# Altium project SVPXFMC_Carrier_3U.PrjPcb (part 1 of 7)
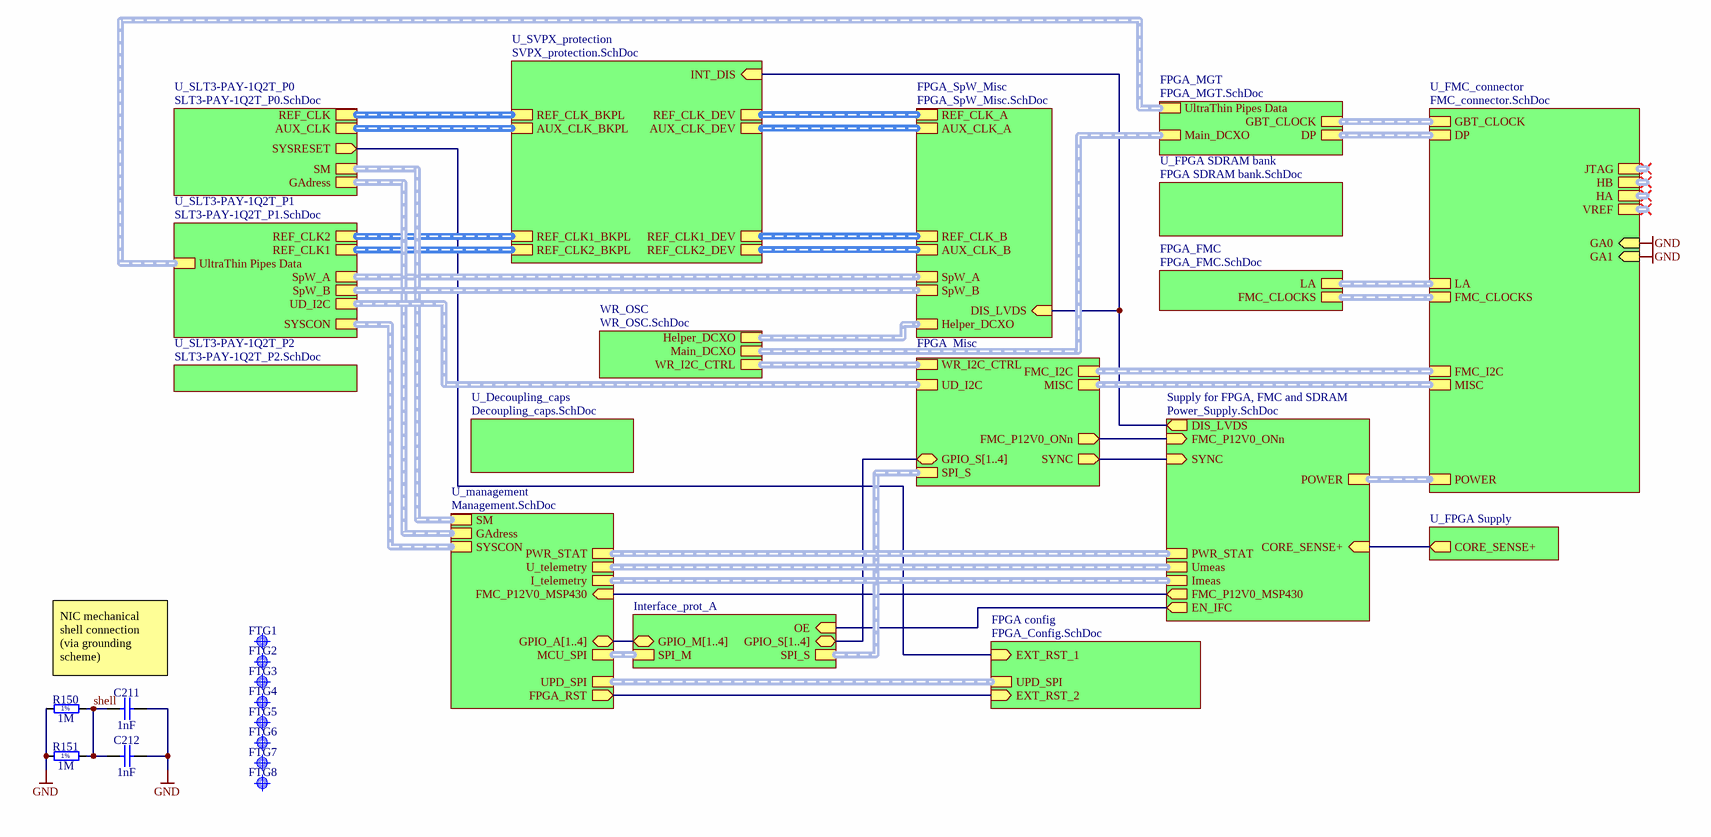
[diagram p0: SVPXFMC_Carrier_3U.SchDoc]
ProjectAddress1: IBP Shanghai; ProjectAddress2: Level 3 - Building 3; ProjectAddress3: No.168 Linhong Road; ProjectAddress4: Shanghai 200335, China; ProjectOrganization: Altium; ProjectTitle: VPX 6U; Template Family: VPX; Template Notes: - Nominal values used, all dimensions are mm.  - Stackup is not specified in AV46DOT0.PDF, nor implemented in this template.  - The component height constraint is defined in AV46DOT0.pdf, page 90.; Template Revision Date: May 2011; Template Source Document: AV46DOT0.pdf; Template Source Name: ANSI/VITA 46.0-2007; Template Source Organization: VITA; Template Source Revision Date: Oct-2007; Template Source URL: www.vita.com
20 sheets, 553 parts. Net scope: hierarchical (ports join the sheet entries above them; power ports are global).
Board file: SVPXFMC_Carrier_3U.PcbDoc
Sheets:
  SVPXFMC_Carrier_3U.SchDoc
    Interface_prot_A = Interface_Protection.SchDoc
    U_FMC_connector = FMC_connector.SchDoc
    FPGA_FMC = FPGA_FMC.SchDoc
    FPGA_Misc = FPGA_Misc.SchDoc
    FPGA_MGT = FPGA_MGT.SchDoc
    Supply for FPGA, FMC and SDRAM = Power_supply.SchDoc
    U_FPGA SDRAM bank = FPGA SDRAM bank.SchDoc
    U_FPGA Supply = FPGA Supply.SchDoc
    FPGA config = FPGA_Config.SchDoc
    U_Decoupling_caps = Decoupling_caps.SchDoc
    FPGA_SpW_Misc = FPGA_SpW_Misc.SchDoc
    U_SLT3-PAY-1Q2T_P0 = SLT3-PAY-1Q2T_P0.SchDoc
    U_SLT3-PAY-1Q2T_P1 = SLT3-PAY-1Q2T_P1.SchDoc
    U_SLT3-PAY-1Q2T_P2 = SLT3-PAY-1Q2T_P2.SchDoc
    U_management = Management.SchDoc
      U_NIC_MSP430_power_jtag = MSP430_power_jtag.SchDoc
    WR_OSC = WR_OSC.SchDoc
    U_SVPX_protection = SVPX_protection.SchDoc
      CLK_prot = CLK_Protection.SchDoc
      CLK_prot_2 = CLK_Protection.SchDoc

## Sheet SVPXFMC_Carrier_3U.SchDoc: SVPXFMC Carrier 3U
size 420 x 297 mm; CheckedBy: \; Author: G.Kasprowicz; CompanyName: ISE; DrawnBy: T.Przywozki; Organization: WUT ISE; Address1: Warsaw University of Technology; Address2: Nowowiejska 15/19 00-665 Warsaw; Revision: 1.0.; SheetNumber: 1; SheetTotal: 20; ModifiedBy: -; CheckedDate: -; Title2: Top; DivGrp: ISE; Designer: G.Kasprowicz; Project: SVPXFMC Carrier 3U; ModifiedDate: -; ProjectName: FMC SFP 4

### Parts
C211  1nF  [CAPC1005X55N]
C212  1nF  [CAPC1005X55N]
FTG1  Use only in PCB  [FIDUCIAL_TOP_C100-200]  (value not drawn)
FTG2  Use only in PCB  [FIDUCIAL_TOP_C100-200]  (value not drawn)
FTG3  Use only in PCB  [FIDUCIAL_TOP_C100-200]  (value not drawn)
FTG4  Use only in PCB  [FIDUCIAL_TOP_C100-200]  (value not drawn)
FTG5  Use only in PCB  [FIDUCIAL_TOP_C100-200]  (value not drawn)
FTG6  Use only in PCB  [FIDUCIAL_TOP_C100-200]  (value not drawn)
FTG7  Use only in PCB  [FIDUCIAL_TOP_C100-200]  (value not drawn)
FTG8  Use only in PCB  [FIDUCIAL_TOP_C100-200]  (value not drawn)
R150  1M  [RESC1005X40N]
R151  1M  [RESC1005X40N]

### Sub-sheets
FPGA config = FPGA_Config.SchDoc: UPD_SPI (harness UPD_SPI), EXT_RST_1 (in), EXT_RST_2 (in)
FPGA_FMC = FPGA_FMC.SchDoc: LA (harness FMC_J1_LA), FMC_CLOCKS (harness FMC_CLOCKS)
FPGA_MGT = FPGA_MGT.SchDoc: GBT_CLOCK (harness GBT_CLOCK), DP (harness FMC_J1_DP), Main_DCXO (harness DIFF_CLK), UltraThin Pipes Data (harness UTP_Data)
FPGA_Misc = FPGA_Misc.SchDoc: SYNC (out), GPIO_S[1..4] (bidir), SPI_S (harness SPI), FMC_I2C (harness I2C), MISC (harness MISC), WR_I2C_CTRL (harness WR_I2C_CTRL), FMC_P12V0_ONn (out), UD_I2C (harness I2C)
FPGA_SpW_Misc = FPGA_SpW_Misc.SchDoc: SpW_B (harness SpW), SpW_A (harness SpW), REF_CLK_A (harness CLK), REF_CLK_B (harness CLK), DIS_LVDS (in), AUX_CLK_A (harness CLK), AUX_CLK_B (harness CLK), Helper_DCXO (harness DIFF_CLK)
Interface_prot_A = Interface_Protection.SchDoc: SPI_M (harness SPI), SPI_S (harness SPI), OE (in), GPIO_S[1..4] (bidir), GPIO_M[1..4] (bidir)
Supply for FPGA, FMC and SDRAM = Power_Supply.SchDoc: Imeas (harness Imeas), SYNC (in), POWER (harness FMC_POWER), CORE_SENSE+ (in), FMC_P12V0_ONn (in), PWR_STAT (harness PWR_STAT), Umeas (harness Umeas), DIS_LVDS (out), EN_IFC (out), FMC_P12V0_MSP430 (out)
U_Decoupling_caps = Decoupling_caps.SchDoc: no entries
U_FMC_connector = FMC_connector.SchDoc: DP (harness FMC_J1_DP), LA (harness FMC_J1_LA), HA (harness FMC_J1_HA), HB (harness FMC_J1_HB), MISC (harness MISC), POWER (harness FMC_POWER), JTAG (harness FMC_J1_JTAG), FMC_I2C (harness I2C), FMC_CLOCKS (harness FMC_CLOCKS), VREF (harness FMC_J1_VREF), GA0 (in), GA1 (in), GBT_CLOCK (harness GBT_CLOCK)
U_FPGA SDRAM bank = FPGA SDRAM bank.SchDoc: no entries
U_FPGA Supply = FPGA Supply.SchDoc: CORE_SENSE+ (out)
U_management = Management.SchDoc: MCU_SPI (harness SPI), SM (harness SM), GAdress (harness GAdress), U_telemetry (harness Umeas), I_telemetry (harness Imeas), FPGA_RST (out), UPD_SPI (harness UPD_SPI), SYSCON (harness SYSCON), PWR_STAT (harness PWR_STAT), GPIO_A[1..4] (bidir), FMC_P12V0_MSP430 (in)
U_SLT3-PAY-1Q2T_P0 = SLT3-PAY-1Q2T_P0.SchDoc: AUX_CLK (harness CLK), REF_CLK (harness CLK), GAdress (harness GAdress), SM (harness SM), SYSRESET (out)
U_SLT3-PAY-1Q2T_P1 = SLT3-PAY-1Q2T_P1.SchDoc: SpW_A (harness SpW), SpW_B (harness SpW), REF_CLK1 (harness CLK), REF_CLK2 (harness CLK), SYSCON (harness SYSCON), UD_I2C (harness I2C), UltraThin Pipes Data
U_SLT3-PAY-1Q2T_P2 = SLT3-PAY-1Q2T_P2.SchDoc: no entries
U_SVPX_protection = SVPX_protection.SchDoc: REF_CLK_BKPL (harness CLK), AUX_CLK_BKPL (harness CLK), AUX_CLK_DEV (harness CLK), REF_CLK_DEV (harness CLK), INT_DIS (in), REF_CLK1_BKPL (harness CLK), REF_CLK2_BKPL (harness CLK), REF_CLK1_DEV (harness CLK), REF_CLK2_DEV (harness CLK)
WR_OSC = WR_OSC.SchDoc: WR_I2C_CTRL (harness WR_I2C_CTRL), Main_DCXO (harness DIFF_CLK), Helper_DCXO (harness DIFF_CLK)

### Nets
GND: C211.2 C212.2 R150.1 R151.1 ; sheet U_FMC_connector/GA0, sheet U_FMC_connector/GA1
CORE_SENSE+: sheet Supply for FPGA, FMC and SDRAM/CORE_SENSE+, sheet U_FPGA Supply/CORE_SENSE+
DIS_LVDS: sheet Supply for FPGA, FMC and SDRAM/DIS_LVDS, sheet FPGA_SpW_Misc/DIS_LVDS, sheet U_SVPX_protection/INT_DIS
EN_IFC: sheet Interface_prot_A/OE, sheet Supply for FPGA, FMC and SDRAM/EN_IFC
EXT_RST_2: sheet FPGA config/EXT_RST_2, sheet U_management/FPGA_RST
FMC_P12V0_MSP430: sheet Supply for FPGA, FMC and SDRAM/FMC_P12V0_MSP430, sheet U_management/FMC_P12V0_MSP430
FMC_P12V0_ONn: sheet FPGA_Misc/FMC_P12V0_ONn, sheet Supply for FPGA, FMC and SDRAM/FMC_P12V0_ONn
shell: C211.1 C212.1 R150.2 R151.2  [project net shell_1]
SYNC: sheet FPGA_Misc/SYNC, sheet Supply for FPGA, FMC and SDRAM/SYNC
SYSRESET*: sheet FPGA config/EXT_RST_1, sheet U_SLT3-PAY-1Q2T_P0/SYSRESET

### Buses and harness runs
bus sheet FPGA_Misc/GPIO_S[1..4] = sheet Interface_prot_A/GPIO_S[1..4]
bus sheet Interface_prot_A/GPIO_M[1..4] = sheet U_management/GPIO_A[1..4]
harness sheet FPGA config/UPD_SPI = sheet U_management/UPD_SPI
harness sheet FPGA_FMC/FMC_CLOCKS = sheet U_FMC_connector/FMC_CLOCKS
harness sheet FPGA_FMC/LA = sheet U_FMC_connector/LA
harness sheet FPGA_MGT/DP = sheet U_FMC_connector/DP
harness sheet FPGA_MGT/GBT_CLOCK = sheet U_FMC_connector/GBT_CLOCK
harness sheet FPGA_MGT/Main_DCXO = sheet WR_OSC/Main_DCXO
harness sheet FPGA_MGT/UltraThin Pipes Data = sheet U_SLT3-PAY-1Q2T_P1/UltraThin Pipes Data
harness sheet FPGA_Misc/FMC_I2C = sheet U_FMC_connector/FMC_I2C
harness sheet FPGA_Misc/MISC = sheet U_FMC_connector/MISC
harness sheet FPGA_Misc/SPI_S = sheet Interface_prot_A/SPI_S
harness sheet FPGA_Misc/UD_I2C = sheet U_SLT3-PAY-1Q2T_P1/UD_I2C
harness sheet FPGA_Misc/WR_I2C_CTRL = sheet WR_OSC/WR_I2C_CTRL
harness sheet FPGA_SpW_Misc/AUX_CLK_A = sheet U_SVPX_protection/AUX_CLK_DEV
harness sheet FPGA_SpW_Misc/AUX_CLK_B = sheet U_SVPX_protection/REF_CLK2_DEV
harness sheet FPGA_SpW_Misc/Helper_DCXO = sheet WR_OSC/Helper_DCXO
harness sheet FPGA_SpW_Misc/REF_CLK_A = sheet U_SVPX_protection/REF_CLK_DEV
harness sheet FPGA_SpW_Misc/REF_CLK_B = sheet U_SVPX_protection/REF_CLK1_DEV
harness sheet FPGA_SpW_Misc/SpW_A = sheet U_SLT3-PAY-1Q2T_P1/SpW_A
harness sheet FPGA_SpW_Misc/SpW_B = sheet U_SLT3-PAY-1Q2T_P1/SpW_B
harness sheet Interface_prot_A/SPI_M = sheet U_management/MCU_SPI
harness sheet Supply for FPGA, FMC and SDRAM/Imeas = sheet U_management/I_telemetry
harness sheet Supply for FPGA, FMC and SDRAM/POWER = sheet U_FMC_connector/POWER
harness sheet Supply for FPGA, FMC and SDRAM/PWR_STAT = sheet U_management/PWR_STAT
harness sheet Supply for FPGA, FMC and SDRAM/Umeas = sheet U_management/U_telemetry
harness sheet U_management/GAdress = sheet U_SLT3-PAY-1Q2T_P0/GAdress
harness sheet U_management/SM = sheet U_SLT3-PAY-1Q2T_P0/SM
harness sheet U_management/SYSCON = sheet U_SLT3-PAY-1Q2T_P1/SYSCON
harness sheet U_SLT3-PAY-1Q2T_P0/AUX_CLK = sheet U_SVPX_protection/AUX_CLK_BKPL
harness sheet U_SLT3-PAY-1Q2T_P0/REF_CLK = sheet U_SVPX_protection/REF_CLK_BKPL
harness sheet U_SLT3-PAY-1Q2T_P1/REF_CLK1 = sheet U_SVPX_protection/REF_CLK2_BKPL
harness sheet U_SLT3-PAY-1Q2T_P1/REF_CLK2 = sheet U_SVPX_protection/REF_CLK1_BKPL

### Notes on the sheet
- NIC mechanical shell connection (via grounding scheme)
- Project/Equipment
- Document
- Designer
- Drawn by
- Check.by
- File
- Last Mod.
- Print Date
- Sheet
- Size
- A3
- of
- Rev
- Copyright WUT ISE 2019
  This documentation describes Open Hardware and is licensed under the CERN OHL v.1.1. You may redistribute and modify this documentation under the terms of the CERN OHL v1.1.
  (http://ohwr.org/CERNOHL). This documentation is dristributed WITHOUT ANY EXPRESS OR IMPLIED WARRANTY, INCLUDING OF MERCHANTABILITY, SATISFACTORY QUALITY AND FITNESS FOR A PARTICULAR PURPOSE. Please see the CERN OHL v.1.1 for applicable conditions
- (in symbol R0402_1M_1%_0.0625W_100PPM) 1%

### Library data of the parts
C211 C212 = CC0402_1NF_50V_10%_X7R: Non-polarised capacitor; Part Description: SMD Multilayer Chip Ceramic Capacitor; Manufacturer: GENERIC; Manufacturer1 Part Number: 223858715623; Voltage: 50V; TC: X7R; Tolerance: ±10%; Part Number: CC0402_1NF_50V_10%_X7R; Component Kind: Standard; Component Type: Standard; Pin Count: 2; Value: 1nF; Status: Not Recommended; Manufacturer Part Number: CC0402_1NF_50V_10%_X7R; Case: 0402; Mounted: Yes; Socket: No; SMD: Yes; Sense: No; Manufacturer1 Example: PHYCOMP; Manufacturer1 ComponentHeight: 0.55mm; HelpURL: \\cern.ch\dfs\Applications\Altium\Datasheets\CC0402_X7R_PHYCOMP.pdf; Author: CERN DEM JLC; CreateDate: 03.12.2007; LatestRevisionDate: 03.12.2007
FTG1-FTG8 = FIDUCIAL_TARGET_C100-200: Fiducial Target; Part Description: Round Fiducial Target, Top Layer, 1.0mm, Top Solder 2.0mm, Keepout =2.0mm; Mounted: No; Part Number: FIDUCIAL_TARGET_C100-200; Component Kind: Standard (No BOM); Component Type: Standard (No BOM); Pin Count: 1; Family: Fiducial; Socket: No; SMD: Yes; Sense: No; Status: None; ComponentHeight: 0mm; HelpURL: Undefined; Author: CERN DEM JLC; CreateDate: 09.02.2010; LatestRevisionDate: 04.04.2012; PackageDescription: Round Fiducial Target, Top Layer, 1.0mm, Top Solder 2.0mm, Keepout =2.0mm
R150 R151 = R0402_1M_1%_0.0625W_100PPM: Resistor - 1%; Part Description: General Purpose Thick Film Chip Resistor; Manufacturer: GENERIC; Manufacturer1 Part Number: 232270671005L; TC: ±100ppm/°C; PressFit: No; Part Number: R0402_1M_1%_0.0625W_100PPM; Component Kind: Standard; Component Type: Standard; Pin Count: 2; Value: 1M; Status: Not Recommended; Power: 0.0625W; Tolerance: ±1%; Manufacturer Part Number: R0402_1M_1%_0.0625W_100PPM; Case: 0402; Mounted: Yes; Sense: No; Socket: No; SMD: Yes; Manufacturer1 Example: YAGEO PHYCOMP; Manufacturer1 ComponentHeight: 0.4mm; HelpURL: \\cern.ch\dfs\Applications\Altium\Datasheets\R0402_Phycomp_RC0402.pdf; Author: CERN DEM JLC; CreateDate: 03.12.2007; LatestRevisionDate: 17.10.2012

## Sheet Interface_Protection.SchDoc: SVPXFMC Carrier 3U
size A4; CheckedBy: \; Author: G.Kasprowicz; CompanyName: ISE; DrawnBy: T.Przywozki; Organization: WUT ISE; Address1: Warsaw University of Technology; Address2: Nowowiejska 15/19 00-665 Warsaw; Revision: 1.0.; SheetNumber: 10; SheetTotal: 20; Project: SVPXFMC Carrier 3U; ModifiedBy: -; CheckedDate: -; Title2: Interface Protection; DivGrp: ISE; Designer: G. Kasprowicz
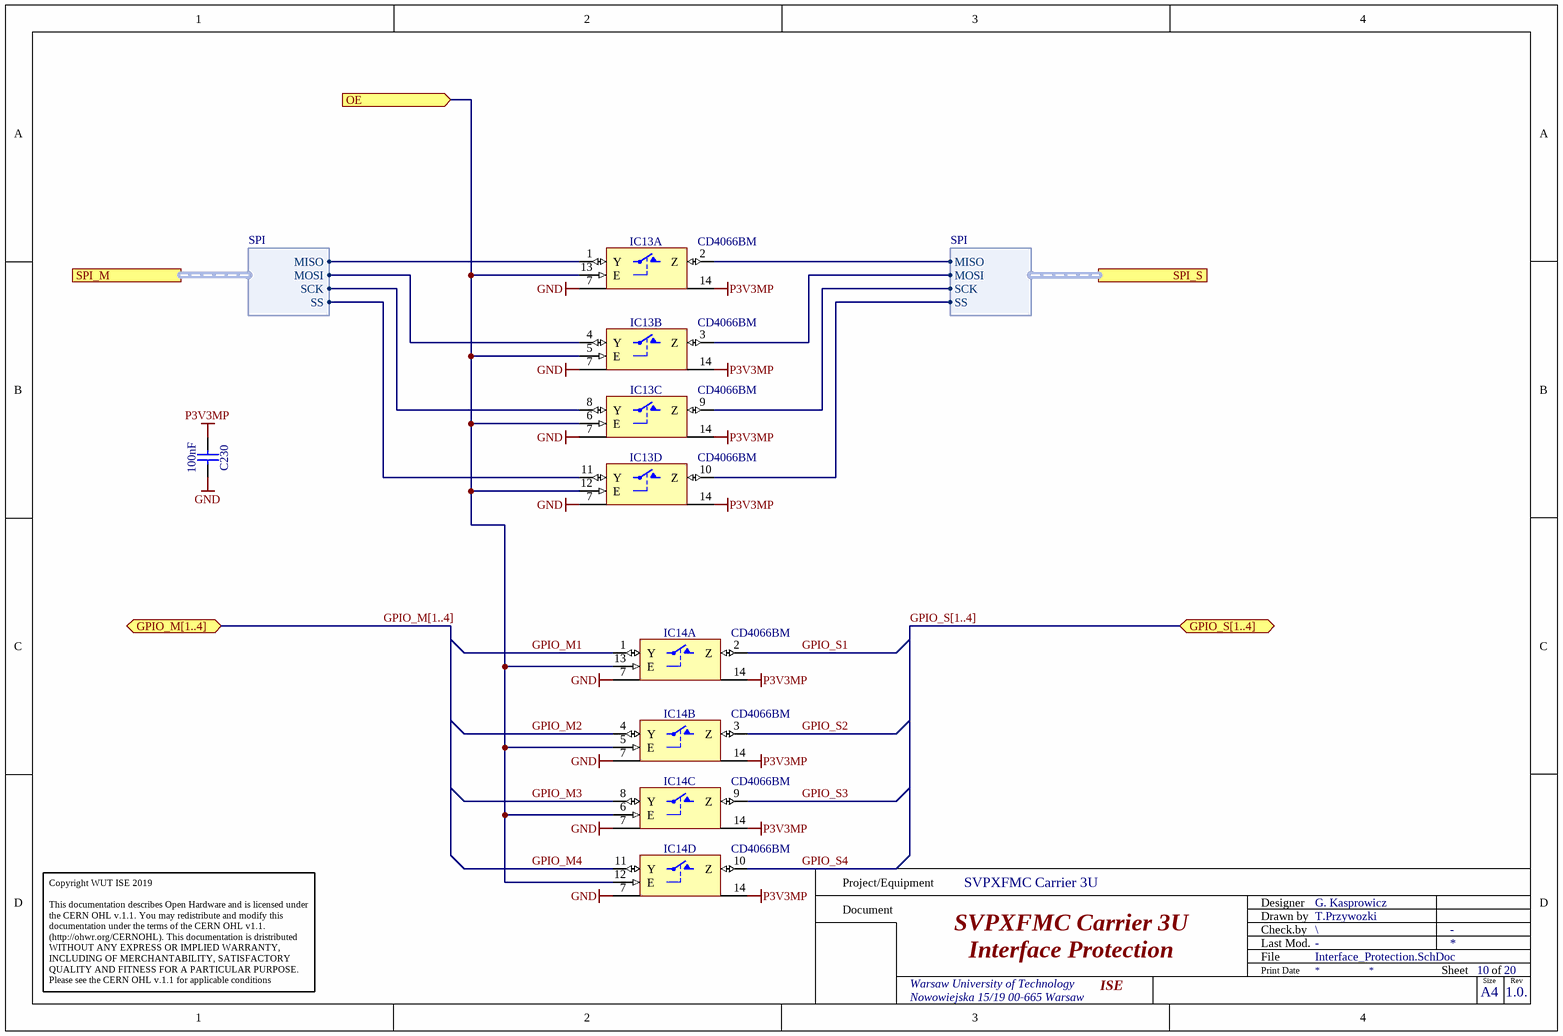
[diagram p1: Interface_Protection.SchDoc]

### Parts
C230  100nF  [CAPC1005X55N]
IC13  CD4066BM  [SOIC127P600X175-14N]  (parts A,B,C,D of 4)
IC14  CD4066BM  [SOIC127P600X175-14N]  (parts A,B,C,D of 4)

### Ports
GPIO_M[1..4] (bidir), GPIO_S[1..4] (bidir), OE (in), SPI_M (harness SPI), SPI_S (harness SPI)

### Harnesses
SPI: MISO, MOSI, SCK, SS

### Nets
GND: C230.2 IC13.7(VSS) IC14.7(VSS)
P3V3MP: C230.1 IC13.14(VDD) IC14.14(VDD)  [also labelled VDD]
EN_IFC: IC13.5(E) IC13.6(E) IC13.12(E) IC13.13(E) IC14.5(E) IC14.6(E) IC14.12(E) IC14.13(E) ; port OE
GPIO_M1: IC14.1(Y)  [project net GPIO_A1]
GPIO_M2: IC14.4(Y)  [project net GPIO_A2]
GPIO_M3: IC14.8(Y)  [project net GPIO_A3]
GPIO_M4: IC14.11(Y)  [project net GPIO_A4]
GPIO_S1: IC14.2(Z)
GPIO_S2: IC14.3(Z)
GPIO_S3: IC14.9(Z)
GPIO_S4: IC14.10(Z)
MISO: IC13.2(Z) ; port SPI_S.MISO
MOSI: IC13.3(Z) ; port SPI_S.MOSI
SCK: IC13.9(Z) ; port SPI_S.SCK
SS: IC13.10(Z) ; port SPI_S.SS
NetIC13_1: IC13.1(Y) ; port SPI_M.MISO
NetIC13_4: IC13.4(Y) ; port SPI_M.MOSI
NetIC13_8: IC13.8(Y) ; port SPI_M.SCK
NetIC13_11: IC13.11(Y) ; port SPI_M.SS

### Buses and harness runs
bus GPIO_M[1..4] = port GPIO_M[1..4]
bus GPIO_S[1..4] = port GPIO_S[1..4]

### Notes on the sheet
- Project/Equipment
- Document
- Designer
- Drawn by
- Check.by
- Copyright WUT ISE 2019
  This documentation describes Open Hardware and is licensed under the CERN OHL v.1.1. You may redistribute and modify this documentation under the terms of the CERN OHL v1.1.
  (http://ohwr.org/CERNOHL). This documentation is dristributed WITHOUT ANY EXPRESS OR IMPLIED WARRANTY, INCLUDING OF MERCHANTABILITY, SATISFACTORY QUALITY AND FITNESS FOR A PARTICULAR PURPOSE. Please see the CERN OHL v.1.1 for applicable conditions
- File
- Last Mod.
- Print Date
- Sheet
- Size
- A4
- of
- Rev

### Library data of the parts
C230 = CC0402_100NF_25V_10%_X7R_YUDEN_TMK105B7104KVHF: Non-polarised capacitor; Part Description: SMD Multilayer Chip Ceramic Capacitor (High Dielectric Type) for Automotive / Industrial Applications; Manufacturer: TAIYO YUDEN; Voltage: 25V; TC: X7R; Tolerance: ±10%; Part Number: CC0402_100NF_25V_10%_X7R_YUDEN_TMK105B7104KVHF; Component Kind: Standard; Component Type: Standard; Pin Count: 2; Value: 100nF; Status: Not Recommended; Manufacturer Part Number: TMK105B7104KVHF; Case: 0402; Mounted: Yes; Socket: No; SMD: Yes; Sense: No; HelpURL: \\cern.ch\dfs\Applications\Altium\Datasheets\CC0402_TAIYO-YUDEN_TMK105B7104KVHF.pdf; Author: CERN DEM JLC; CreateDate: 10/05/2017; LatestRevisionDate: 10/05/2017; ComponentHeight: 0.55mm
IC13 IC14 = CD4066BM: Part Description: CMOS Quad Bilateral Switch; Manufacturer: TEXAS INSTRUMENTS; PressFit: No; Bonding: No; Part Number: CD4066BM; Component Kind: Standard; Component Type: Standard; Device: CD4066BM; PackageDescription: SOIC 14, Pitch 1.27mm - Body 4x8.75mm, IPC Medium Density; Manufacturer Part Number: CD4066BM; Pin Count: 14; Case: SOIC14; Mounted: Yes; Socket: No; SMD: Yes; Sense: No; ComponentHeight: 1.75mm; Author: CERN DEM MR; HelpURL: \\cern.ch\dfs\Applications\Altium\Datasheets\CD4066BM.pdf; CreateDate: 2016-01-21; LatestRevisionDate: 2016-01-21

## Sheet FMC_connector.SchDoc: SVPXFMC Carrier 3U
size A2; CheckedBy: \; Author: G.Kasprowicz; CompanyName: ISE; DrawnBy: T.Przywozki; Organization: WUT ISE; Address1: Warsaw University of Technology; Address2: Nowowiejska 15/19 00-665 Warsaw; Revision: 1.0.; SheetNumber: 4; SheetTotal: 20; Projet: SVPXFMC Carrier 3U; ModifiedBy: -; CheckedDate: -; Title2: FMC Connector; DivGrp: ISE; Designer: G.Kasprowicz; Project: SVPXFMC Carrier 3U
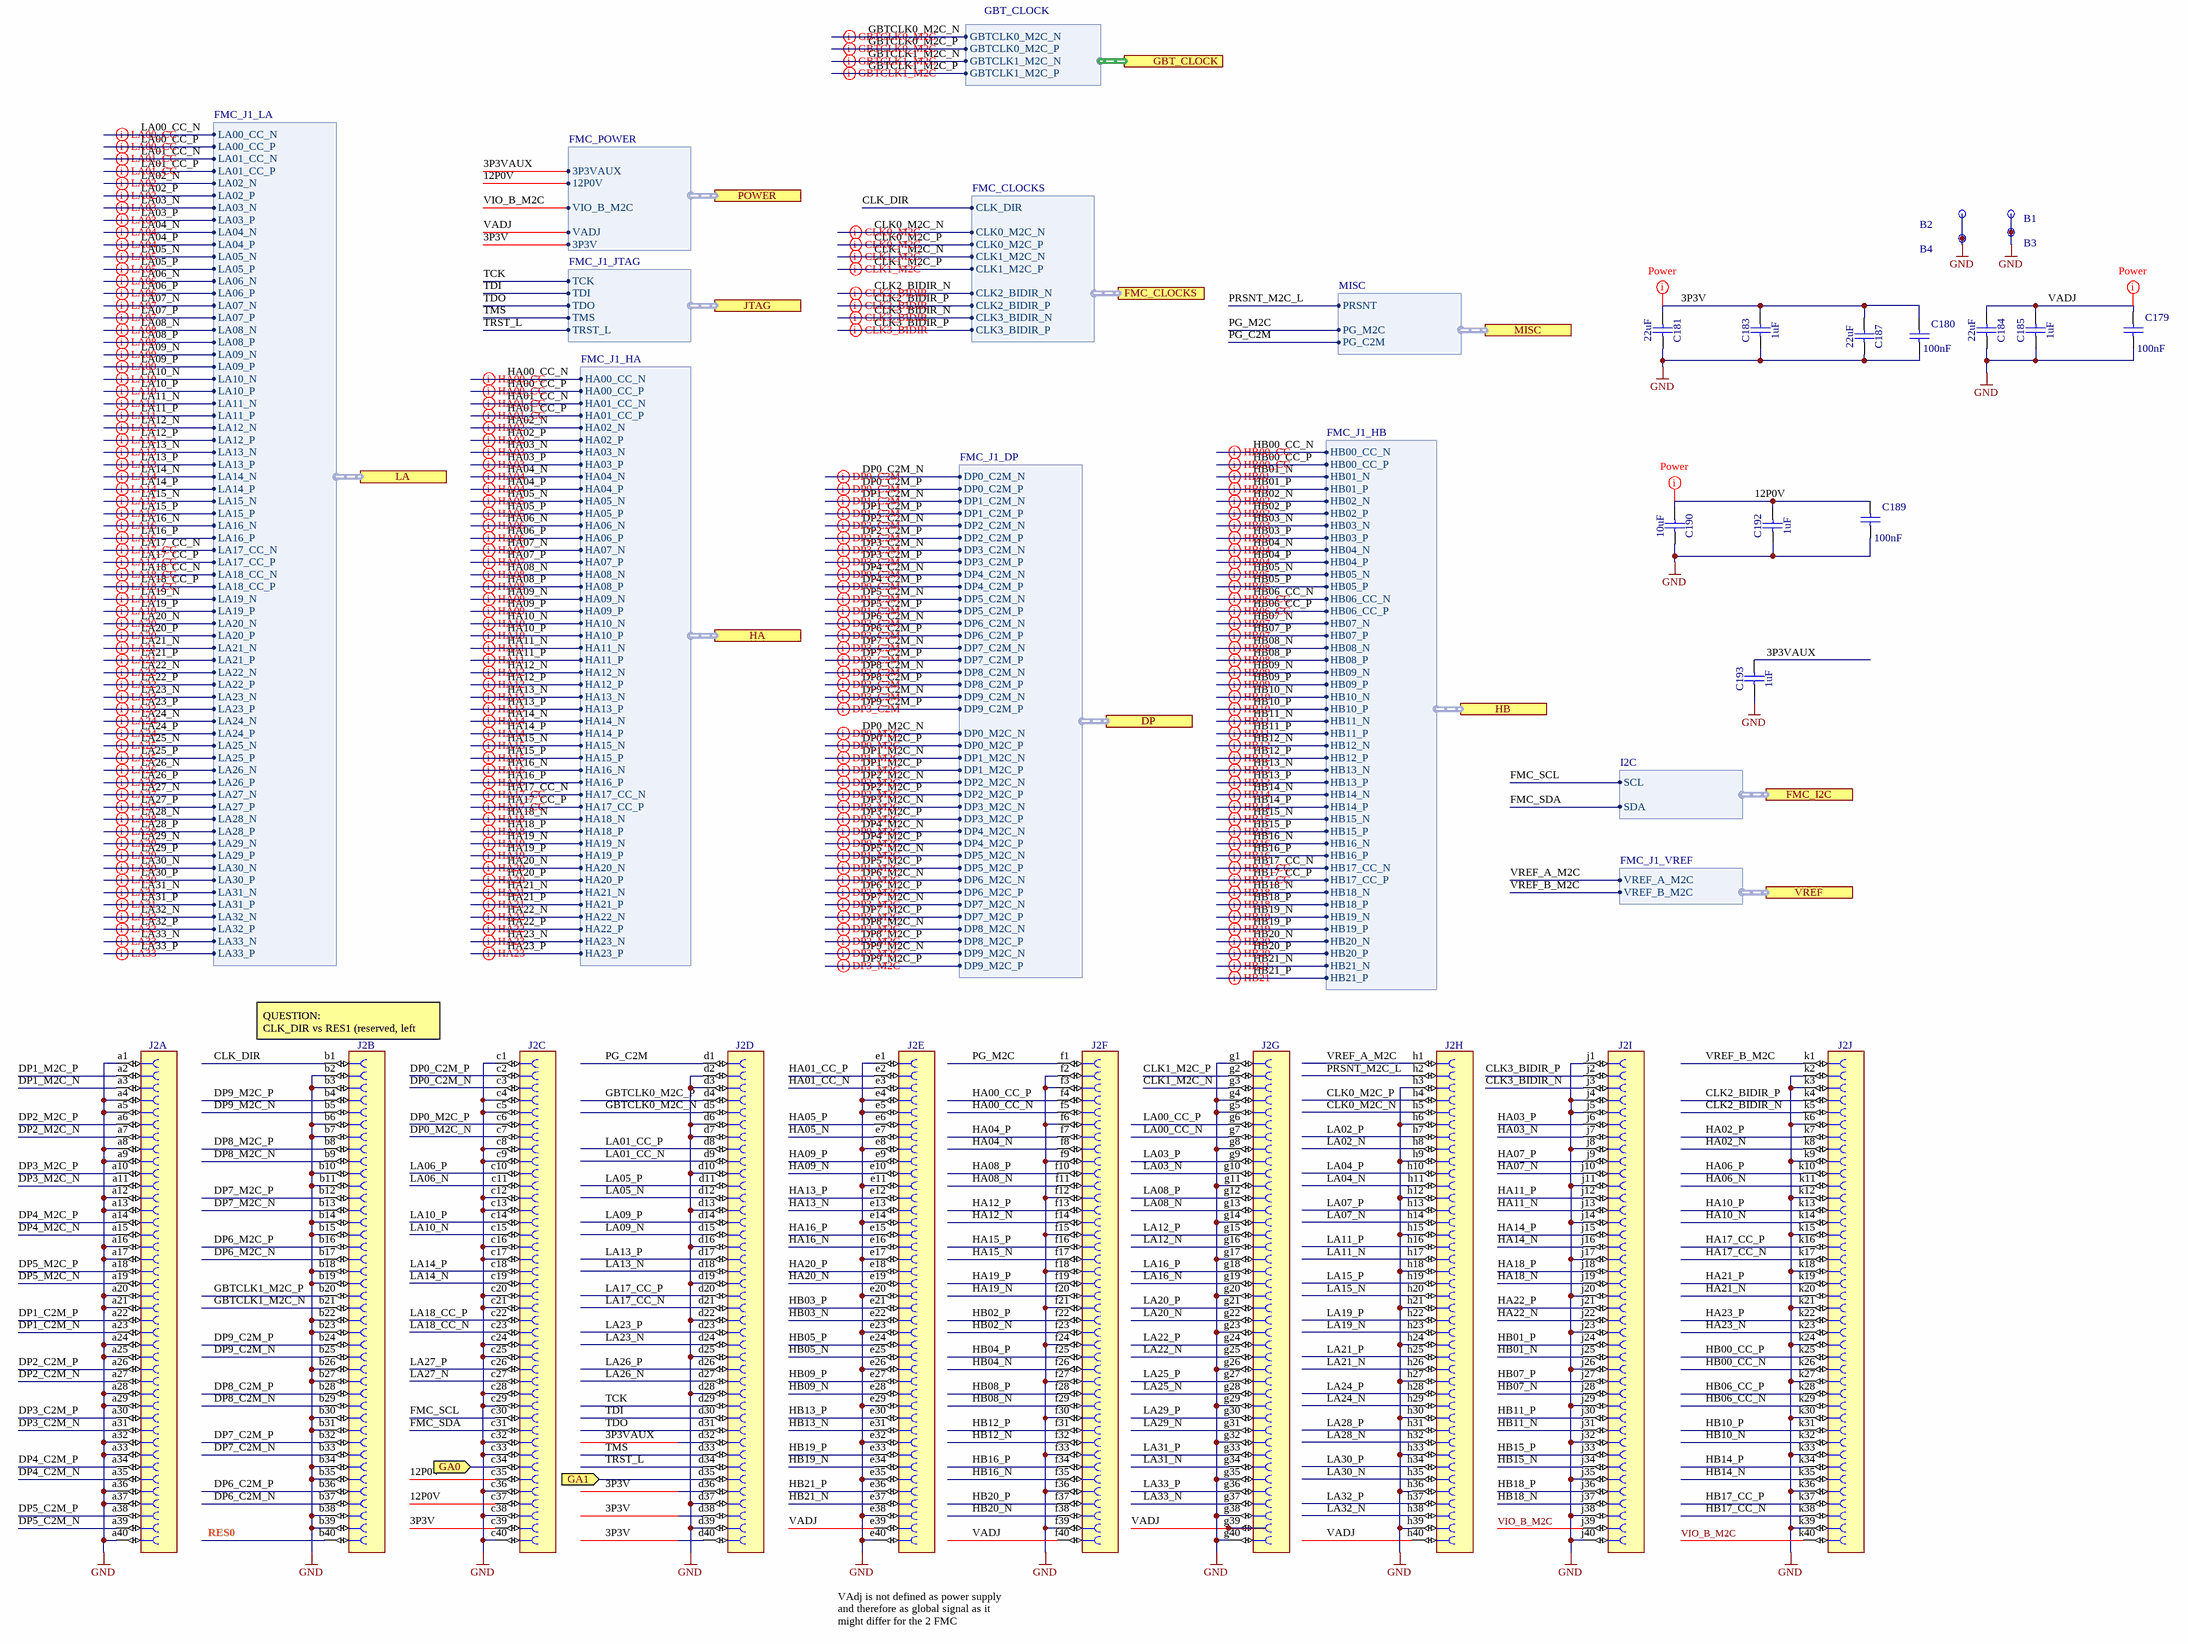
[diagram p2: FMC_connector.SchDoc]

### Parts
B1  Plated Hole  [MTG270_500]  (value not drawn)
B2  Plated Hole  [MTG270_500]  (value not drawn)
B3  Plated Hole  [MTG270_500]  (value not drawn)
B4  Plated Hole  [MTG270_500]  (value not drawn)
C179  100nF  [CAPC0603X33N]
C180  100nF  [CAPC0603X33N]
C181  22uF  [CAPC3216X180N]
C183  1uF  [CAPC1608X87N]
C184  22uF  [CAPC3216X180N]
C185  1uF  [CAPC1608X87N]
C187  22uF  [CAPC3216X180N]
C189  100nF  [CAPC0603X33N]
C190  10uF  [CAPC2012X135N]
C192  1uF  [CAPC1608X87N]
C193  1uF  [CAPC1608X87N]
J2  VITA 57  [SAMTEC_ASP-134486-01]  (value not drawn)  (parts A,B,C,D,E,F,G,H,I,J of 10)

### Ports
DP (harness FMC_J1_DP), FMC_CLOCKS (harness FMC_CLOCKS), FMC_I2C (harness I2C), GA0 (in), GA1 (in), GBT_CLOCK (harness GBT_CLOCK), HA (harness FMC_J1_HA), HB (harness FMC_J1_HB), JTAG (harness FMC_J1_JTAG), LA (harness FMC_J1_LA), MISC (harness MISC), POWER (harness FMC_POWER), VREF (harness FMC_J1_VREF)

### Harnesses
FMC_J1_DP: DP1_C2M_N, DP1_C2M_P, DP1_M2C_N, DP1_M2C_P, DP2_C2M_N, DP2_C2M_P, DP2_M2C_N, DP2_M2C_P, DP3_C2M_N, DP3_C2M_P, DP3_M2C_N, DP3_M2C_P, DP0_C2M_N, DP0_C2M_P, DP0_M2C_N, DP0_M2C_P, DP4_C2M_N, DP4_C2M_P, DP5_C2M_N, DP5_C2M_P, DP6_C2M_N, DP6_C2M_P, DP7_C2M_N, DP7_C2M_P, DP8_C2M_N, DP8_C2M_P, DP9_C2M_N, DP9_C2M_P, DP4_M2C_N, DP4_M2C_P, DP5_M2C_N, DP5_M2C_P, DP6_M2C_N, DP6_M2C_P, DP7_M2C_N, DP7_M2C_P, DP8_M2C_N, DP8_M2C_P, DP9_M2C_N, DP9_M2C_P
FMC_J1_LA: LA05_N, LA05_P, LA06_N, LA06_P, LA09_N, LA09_P, LA10_N, LA10_P, LA13_N, LA13_P, LA14_N, LA14_P, LA23_N, LA23_P, LA26_N, LA26_P, LA27_N, LA27_P, LA02_N, LA02_P, LA03_N, LA03_P, LA04_N, LA04_P, LA07_N, LA07_P, LA08_N, LA08_P, LA11_N, LA11_P, LA12_N, LA12_P, LA15_N, LA15_P, LA16_N, LA16_P, LA19_N, LA19_P, LA20_N, LA20_P, LA21_N, LA21_P, LA22_N, LA22_P, LA24_N, LA24_P, LA25_N, LA25_P, LA28_N, LA28_P, LA29_N, LA29_P, LA30_N, LA30_P, LA31_N, LA31_P, LA32_N, LA32_P, LA33_N, LA33_P, LA00_CC_N, LA00_CC_P, LA01_CC_N, LA01_CC_P, LA17_CC_N, LA17_CC_P, LA18_CC_N, LA18_CC_P
FMC_J1_HA: HA04_N, HA04_P, HA05_N, HA05_P, HA08_N, HA08_P, HA09_N, HA09_P, HA12_N, HA12_P, HA13_N, HA13_P, HA15_N, HA15_P, HA16_N, HA16_P, HA19_N, HA19_P, HA20_N, HA20_P, HA02_N, HA02_P, HA03_N, HA03_P, HA06_N, HA06_P, HA07_N, HA07_P, HA10_N, HA10_P, HA11_N, HA11_P, HA14_N, HA14_P, HA18_N, HA18_P, HA21_N, HA21_P, HA22_N, HA22_P, HA23_N, HA23_P, HA17_CC_N, HA17_CC_P, HA00_CC_N, HA00_CC_P, HA01_CC_N, HA01_CC_P
FMC_J1_HB: HB02_N, HB02_P, HB03_N, HB03_P, HB04_N, HB04_P, HB05_N, HB05_P, HB08_N, HB08_P, HB09_N, HB09_P, HB12_N, HB12_P, HB13_N, HB13_P, HB16_N, HB16_P, HB19_N, HB19_P, HB20_N, HB20_P, HB21_N, HB21_P, HB01_N, HB01_P, HB07_N, HB07_P, HB10_N, HB10_P, HB11_N, HB11_P, HB14_N, HB14_P, HB15_N, HB15_P, HB18_N, HB18_P, HB17_CC_N, HB17_CC_P, HB06_CC_N, HB06_CC_P, HB00_CC_N, HB00_CC_P
FMC_POWER: 3P3VAUX, 12P0V, VIO_B_M2C, VADJ, 3P3V
FMC_J1_JTAG: TCK, TDI, TDO, TMS, TRST_L
I2C: SCL, SDA
FMC_CLOCKS: CLK2_BIDIR_N, CLK2_BIDIR_P, CLK3_BIDIR_N, CLK3_BIDIR_P, CLK0_M2C_N, CLK0_M2C_P, CLK1_M2C_N, CLK1_M2C_P, CLK_DIR
FMC_J1_VREF: VREF_A_M2C, VREF_B_M2C
GBT_CLOCK: GBTCLK0_M2C_N, GBTCLK0_M2C_P, GBTCLK1_M2C_N, GBTCLK1_M2C_P
MISC: PRSNT, PG_M2C, PG_C2M

### Nets
GND: B1.1 B2.1 B3.1 B4.1 C179.1 C180.1 C181.2 C183.1 C184.2 C185.1 C187.2 C189.1 C190.2 C192.1 C193.1 J2.a1 J2.a4 J2.a5 J2.a8 J2.a9 J2.a12 J2.a13 J2.a16 J2.a17 J2.a20 J2.a21 J2.a24 J2.a25 J2.a28 J2.a29 J2.a32 J2.a33 J2.a36 J2.a37 J2.a40 J2.b2 J2.b3 J2.b6 J2.b7 J2.b10 J2.b11 J2.b14 J2.b15 J2.b18 J2.b19 J2.b22 J2.b23 J2.b26 J2.b27 J2.b30 J2.b31 J2.b34 J2.b35 J2.b38 J2.b39 J2.c1 J2.c4 J2.c5 J2.c8 J2.c9 J2.c12 J2.c13 J2.c16 J2.c17 J2.c20 J2.c21 J2.c24 J2.c25 J2.c28 J2.c29 J2.c32 J2.c33 J2.c34 J2.c36 J2.c38 J2.c40 J2.d2 J2.d3 J2.d6 J2.d7 J2.d10 J2.d13 J2.d16 J2.d19 J2.d22 J2.d25 J2.d28 J2.d35 J2.d37 J2.d39 J2.e1 J2.e4 J2.e5 J2.e8 J2.e11 J2.e14 J2.e17 J2.e20 J2.e23 J2.e26 J2.e29 J2.e32 J2.e35 J2.e38 J2.e40 J2.f2 J2.f3 J2.f6 J2.f9 J2.f12 J2.f15 J2.f18 J2.f21 J2.f24 J2.f27 J2.f30 J2.f33 J2.f36 J2.f39 J2.g1 J2.g4 J2.g5 J2.g8 J2.g11 J2.g14 J2.g17 J2.g20 J2.g23 J2.g26 J2.g29 J2.g32 J2.g35 J2.g38 J2.g40 J2.h3 J2.h6 J2.h9 J2.h12 J2.h15 J2.h18 J2.h21 J2.h24 J2.h27 J2.h30 J2.h33 J2.h36 J2.h39 J2.j1 J2.j4 J2.j5 J2.j8 J2.j11 J2.j14 J2.j17 J2.j20 J2.j23 J2.j26 J2.j29 J2.j32 J2.j35 J2.j38 J2.j40 J2.k2 J2.k3 J2.k6 J2.k9 J2.k12 J2.k15 J2.k18 J2.k21 J2.k24 J2.k27 J2.k30 J2.k33 J2.k36 J2.k39 ; port GA0, port GA1
3P3V: C180.2 C181.1 C183.2 C187.1 J2.c39 J2.d36 J2.d38 J2.d40 ; port POWER.3P3V
3P3VAUX: C193.2 J2.d32 ; port POWER.3P3VAUX
12P0V: C189.2 C190.1 C192.2 J2.c35 J2.c37 ; port POWER.12P0V
CLK0_M2C_N: J2.h5 ; port FMC_CLOCKS.CLK0_M2C_N
CLK0_M2C_P: J2.h4 ; port FMC_CLOCKS.CLK0_M2C_P
CLK1_M2C_N: J2.g3 ; port FMC_CLOCKS.CLK1_M2C_N
CLK1_M2C_P: J2.g2 ; port FMC_CLOCKS.CLK1_M2C_P
CLK2_BIDIR_N: J2.k5 ; port FMC_CLOCKS.CLK2_BIDIR_N
CLK2_BIDIR_P: J2.k4 ; port FMC_CLOCKS.CLK2_BIDIR_P
CLK3_BIDIR_N: J2.j3 ; port FMC_CLOCKS.CLK3_BIDIR_N
CLK3_BIDIR_P: J2.j2 ; port FMC_CLOCKS.CLK3_BIDIR_P
CLK_DIR: J2.b1 ; port FMC_CLOCKS.CLK_DIR
DP0_C2M_N: J2.c3 ; port DP.DP0_C2M_N
DP0_C2M_P: J2.c2 ; port DP.DP0_C2M_P
DP0_M2C_N: J2.c7 ; port DP.DP0_M2C_N
DP0_M2C_P: J2.c6 ; port DP.DP0_M2C_P
DP1_C2M_N: J2.a23 ; port DP.DP1_C2M_N
DP1_C2M_P: J2.a22 ; port DP.DP1_C2M_P
DP1_M2C_N: J2.a3 ; port DP.DP1_M2C_N
DP1_M2C_P: J2.a2 ; port DP.DP1_M2C_P
DP2_C2M_N: J2.a27 ; port DP.DP2_C2M_N
DP2_C2M_P: J2.a26 ; port DP.DP2_C2M_P
DP2_M2C_N: J2.a7 ; port DP.DP2_M2C_N
DP2_M2C_P: J2.a6 ; port DP.DP2_M2C_P
DP3_C2M_N: J2.a31 ; port DP.DP3_C2M_N
DP3_C2M_P: J2.a30 ; port DP.DP3_C2M_P
DP3_M2C_N: J2.a11 ; port DP.DP3_M2C_N
DP3_M2C_P: J2.a10 ; port DP.DP3_M2C_P
DP4_C2M_N: J2.a35 ; port DP.DP4_C2M_N
DP4_C2M_P: J2.a34 ; port DP.DP4_C2M_P
DP4_M2C_N: J2.a15 ; port DP.DP4_M2C_N
DP4_M2C_P: J2.a14 ; port DP.DP4_M2C_P
DP5_C2M_N: J2.a39 ; port DP.DP5_C2M_N
DP5_C2M_P: J2.a38 ; port DP.DP5_C2M_P
DP5_M2C_N: J2.a19 ; port DP.DP5_M2C_N
DP5_M2C_P: J2.a18 ; port DP.DP5_M2C_P
DP6_C2M_N: J2.b37 ; port DP.DP6_C2M_N
DP6_C2M_P: J2.b36 ; port DP.DP6_C2M_P
DP6_M2C_N: J2.b17 ; port DP.DP6_M2C_N
DP6_M2C_P: J2.b16 ; port DP.DP6_M2C_P
DP7_C2M_N: J2.b33 ; port DP.DP7_C2M_N
DP7_C2M_P: J2.b32 ; port DP.DP7_C2M_P
DP7_M2C_N: J2.b13 ; port DP.DP7_M2C_N
DP7_M2C_P: J2.b12 ; port DP.DP7_M2C_P
DP8_C2M_N: J2.b29 ; port DP.DP8_C2M_N
DP8_C2M_P: J2.b28 ; port DP.DP8_C2M_P
DP8_M2C_N: J2.b9 ; port DP.DP8_M2C_N
DP8_M2C_P: J2.b8 ; port DP.DP8_M2C_P
DP9_C2M_N: J2.b25 ; port DP.DP9_C2M_N
DP9_C2M_P: J2.b24 ; port DP.DP9_C2M_P
DP9_M2C_N: J2.b5 ; port DP.DP9_M2C_N
DP9_M2C_P: J2.b4 ; port DP.DP9_M2C_P
FMC_SCL: J2.c30 ; port FMC_I2C.SCL
FMC_SDA: J2.c31 ; port FMC_I2C.SDA
GBTCLK0_M2C_N: J2.d5 ; port GBT_CLOCK.GBTCLK0_M2C_N
GBTCLK0_M2C_P: J2.d4 ; port GBT_CLOCK.GBTCLK0_M2C_P
GBTCLK1_M2C_N: J2.b21 ; port GBT_CLOCK.GBTCLK1_M2C_N
GBTCLK1_M2C_P: J2.b20 ; port GBT_CLOCK.GBTCLK1_M2C_P
HA00_CC_N: J2.f5 ; port HA.HA00_CC_N
HA00_CC_P: J2.f4 ; port HA.HA00_CC_P
HA01_CC_N: J2.e3 ; port HA.HA01_CC_N
HA01_CC_P: J2.e2 ; port HA.HA01_CC_P
HA02_N: J2.k8 ; port HA.HA02_N
HA02_P: J2.k7 ; port HA.HA02_P
HA03_N: J2.j7 ; port HA.HA03_N
HA03_P: J2.j6 ; port HA.HA03_P
HA04_N: J2.f8 ; port HA.HA04_N
HA04_P: J2.f7 ; port HA.HA04_P
HA05_N: J2.e7 ; port HA.HA05_N
HA05_P: J2.e6 ; port HA.HA05_P
HA06_N: J2.k11 ; port HA.HA06_N
HA06_P: J2.k10 ; port HA.HA06_P
HA07_N: J2.j10 ; port HA.HA07_N
HA07_P: J2.j9 ; port HA.HA07_P
HA08_N: J2.f11 ; port HA.HA08_N
HA08_P: J2.f10 ; port HA.HA08_P
HA09_N: J2.e10 ; port HA.HA09_N
HA09_P: J2.e9 ; port HA.HA09_P
HA10_N: J2.k14 ; port HA.HA10_N
HA10_P: J2.k13 ; port HA.HA10_P
HA11_N: J2.j13 ; port HA.HA11_N
HA11_P: J2.j12 ; port HA.HA11_P
HA12_N: J2.f14 ; port HA.HA12_N
HA12_P: J2.f13 ; port HA.HA12_P
HA13_N: J2.e13 ; port HA.HA13_N
HA13_P: J2.e12 ; port HA.HA13_P
HA14_N: J2.j16 ; port HA.HA14_N
HA14_P: J2.j15 ; port HA.HA14_P
HA15_N: J2.f17 ; port HA.HA15_N
HA15_P: J2.f16 ; port HA.HA15_P
HA16_N: J2.e16 ; port HA.HA16_N
HA16_P: J2.e15 ; port HA.HA16_P
HA17_CC_N: J2.k17 ; port HA.HA17_CC_N
HA17_CC_P: J2.k16 ; port HA.HA17_CC_P
HA18_N: J2.j19 ; port HA.HA18_N
HA18_P: J2.j18 ; port HA.HA18_P
HA19_N: J2.f20 ; port HA.HA19_N
HA19_P: J2.f19 ; port HA.HA19_P
HA20_N: J2.e19 ; port HA.HA20_N
HA20_P: J2.e18 ; port HA.HA20_P
HA21_N: J2.k20 ; port HA.HA21_N
HA21_P: J2.k19 ; port HA.HA21_P
HA22_N: J2.j22 ; port HA.HA22_N
HA22_P: J2.j21 ; port HA.HA22_P
HA23_N: J2.k23 ; port HA.HA23_N
HA23_P: J2.k22 ; port HA.HA23_P
HB00_CC_N: J2.k26 ; port HB.HB00_CC_N
HB00_CC_P: J2.k25 ; port HB.HB00_CC_P
HB01_N: J2.j25 ; port HB.HB01_N
HB01_P: J2.j24 ; port HB.HB01_P
HB02_N: J2.f23 ; port HB.HB02_N
HB02_P: J2.f22 ; port HB.HB02_P
HB03_N: J2.e22 ; port HB.HB03_N
HB03_P: J2.e21 ; port HB.HB03_P
HB04_N: J2.f26 ; port HB.HB04_N
HB04_P: J2.f25 ; port HB.HB04_P
HB05_N: J2.e25 ; port HB.HB05_N
HB05_P: J2.e24 ; port HB.HB05_P
HB06_CC_N: J2.k29 ; port HB.HB06_CC_N
HB06_CC_P: J2.k28 ; port HB.HB06_CC_P
HB07_N: J2.j28 ; port HB.HB07_N
HB07_P: J2.j27 ; port HB.HB07_P
HB08_N: J2.f29 ; port HB.HB08_N
HB08_P: J2.f28 ; port HB.HB08_P
HB09_N: J2.e28 ; port HB.HB09_N
HB09_P: J2.e27 ; port HB.HB09_P
HB10_N: J2.k32 ; port HB.HB10_N
HB10_P: J2.k31 ; port HB.HB10_P
HB11_N: J2.j31 ; port HB.HB11_N
HB11_P: J2.j30 ; port HB.HB11_P
HB12_N: J2.f32 ; port HB.HB12_N
HB12_P: J2.f31 ; port HB.HB12_P
HB13_N: J2.e31 ; port HB.HB13_N
HB13_P: J2.e30 ; port HB.HB13_P
HB14_N: J2.k35 ; port HB.HB14_N
HB14_P: J2.k34 ; port HB.HB14_P
HB15_N: J2.j34 ; port HB.HB15_N
HB15_P: J2.j33 ; port HB.HB15_P
HB16_N: J2.f35 ; port HB.HB16_N
HB16_P: J2.f34 ; port HB.HB16_P
HB17_CC_N: J2.k38 ; port HB.HB17_CC_N
HB17_CC_P: J2.k37 ; port HB.HB17_CC_P
HB18_N: J2.j37 ; port HB.HB18_N
HB18_P: J2.j36 ; port HB.HB18_P
HB19_N: J2.e34 ; port HB.HB19_N
HB19_P: J2.e33 ; port HB.HB19_P
HB20_N: J2.f38 ; port HB.HB20_N
HB20_P: J2.f37 ; port HB.HB20_P
HB21_N: J2.e37 ; port HB.HB21_N
HB21_P: J2.e36 ; port HB.HB21_P
LA00_CC_N: J2.g7 ; port LA.LA00_CC_N
LA00_CC_P: J2.g6 ; port LA.LA00_CC_P
LA01_CC_N: J2.d9 ; port LA.LA01_CC_N
LA01_CC_P: J2.d8 ; port LA.LA01_CC_P
LA02_N: J2.h8 ; port LA.LA02_N
LA02_P: J2.h7 ; port LA.LA02_P
LA03_N: J2.g10 ; port LA.LA03_N
LA03_P: J2.g9 ; port LA.LA03_P
LA04_N: J2.h11 ; port LA.LA04_N
LA04_P: J2.h10 ; port LA.LA04_P
LA05_N: J2.d12 ; port LA.LA05_N
LA05_P: J2.d11 ; port LA.LA05_P
LA06_N: J2.c11 ; port LA.LA06_N
LA06_P: J2.c10 ; port LA.LA06_P
LA07_N: J2.h14 ; port LA.LA07_N
LA07_P: J2.h13 ; port LA.LA07_P
LA08_N: J2.g13 ; port LA.LA08_N
LA08_P: J2.g12 ; port LA.LA08_P
LA09_N: J2.d15 ; port LA.LA09_N
LA09_P: J2.d14 ; port LA.LA09_P
LA10_N: J2.c15 ; port LA.LA10_N
LA10_P: J2.c14 ; port LA.LA10_P
LA11_N: J2.h17 ; port LA.LA11_N
LA11_P: J2.h16 ; port LA.LA11_P
LA12_N: J2.g16 ; port LA.LA12_N
LA12_P: J2.g15 ; port LA.LA12_P
LA13_N: J2.d18 ; port LA.LA13_N
LA13_P: J2.d17 ; port LA.LA13_P
LA14_N: J2.c19 ; port LA.LA14_N
LA14_P: J2.c18 ; port LA.LA14_P
LA15_N: J2.h20 ; port LA.LA15_N
LA15_P: J2.h19 ; port LA.LA15_P
LA16_N: J2.g19 ; port LA.LA16_N
LA16_P: J2.g18 ; port LA.LA16_P
LA17_CC_N: J2.d21 ; port LA.LA17_CC_N
LA17_CC_P: J2.d20 ; port LA.LA17_CC_P
LA18_CC_N: J2.c23 ; port LA.LA18_CC_N
LA18_CC_P: J2.c22 ; port LA.LA18_CC_P
LA19_N: J2.h23 ; port LA.LA19_N
LA19_P: J2.h22 ; port LA.LA19_P
LA20_N: J2.g22 ; port LA.LA20_N
LA20_P: J2.g21 ; port LA.LA20_P
LA21_N: J2.h26 ; port LA.LA21_N
LA21_P: J2.h25 ; port LA.LA21_P
LA22_N: J2.g25 ; port LA.LA22_N
LA22_P: J2.g24 ; port LA.LA22_P
LA23_N: J2.d24 ; port LA.LA23_N
LA23_P: J2.d23 ; port LA.LA23_P
LA24_N: J2.h29 ; port LA.LA24_N
LA24_P: J2.h28 ; port LA.LA24_P
LA25_N: J2.g28 ; port LA.LA25_N
LA25_P: J2.g27 ; port LA.LA25_P
LA26_N: J2.d27 ; port LA.LA26_N
LA26_P: J2.d26 ; port LA.LA26_P
LA27_N: J2.c27 ; port LA.LA27_N
LA27_P: J2.c26 ; port LA.LA27_P
LA28_N: J2.h32 ; port LA.LA28_N
LA28_P: J2.h31 ; port LA.LA28_P
LA29_N: J2.g31 ; port LA.LA29_N
LA29_P: J2.g30 ; port LA.LA29_P
LA30_N: J2.h35 ; port LA.LA30_N
LA30_P: J2.h34 ; port LA.LA30_P
LA31_N: J2.g34 ; port LA.LA31_N
LA31_P: J2.g33 ; port LA.LA31_P
LA32_N: J2.h38 ; port LA.LA32_N
LA32_P: J2.h37 ; port LA.LA32_P
LA33_N: J2.g37 ; port LA.LA33_N
LA33_P: J2.g36 ; port LA.LA33_P
PG_C2M: J2.d1 ; port MISC.PG_C2M
PG_M2C: J2.f1 ; port MISC.PG_M2C
PRSNT_M2C_L: J2.h2 ; port MISC.PRSNT
TCK: J2.d29 ; port JTAG.TCK
TDI: J2.d30 ; port JTAG.TDI
TDO: J2.d31 ; port JTAG.TDO
TMS: J2.d33 ; port JTAG.TMS
TRST_L: J2.d34 ; port JTAG.TRST_L
VADJ: C179.2 C184.1 C185.2 J2.e39 J2.f40 J2.g39 J2.h40 ; port POWER.VADJ
VIO_B_M2C: J2.j39 J2.k40 ; port POWER.VIO_B_M2C
VREF_A_M2C: J2.h1 ; port VREF.VREF_A_M2C
VREF_B_M2C: J2.k1 ; port VREF.VREF_B_M2C

Not connected (* = marked no-connect by the designer): J2 b40

### Layout directives
differential pair: CLK0_M2C_N, CLK0_M2C_P, CLK1_M2C_N, CLK1_M2C_P, CLK2_BIDIR_N, CLK2_BIDIR_P, CLK3_BIDIR_N, CLK3_BIDIR_P, DP0_C2M_N, DP0_C2M_P, DP0_M2C_N, DP0_M2C_P, DP1_C2M_N, DP1_C2M_P, DP1_M2C_N, DP1_M2C_P, DP2_C2M_N, DP2_C2M_P, DP2_M2C_N, DP2_M2C_P, DP3_C2M_N, DP3_C2M_P, DP3_M2C_N, DP3_M2C_P, DP4_C2M_N, DP4_C2M_P, DP4_M2C_N, DP4_M2C_P, DP5_C2M_N, DP5_C2M_P, DP5_M2C_N, DP5_M2C_P, DP6_C2M_N, DP6_C2M_P, DP6_M2C_N, DP6_M2C_P, DP7_C2M_N, DP7_C2M_P, DP7_M2C_N, DP7_M2C_P, DP8_C2M_N, DP8_C2M_P, DP8_M2C_N, DP8_M2C_P, DP9_C2M_N, DP9_C2M_P, DP9_M2C_N, DP9_M2C_P, GBTCLK0_M2C_N, GBTCLK0_M2C_P, GBTCLK1_M2C_N, GBTCLK1_M2C_P, HA00_CC_N, HA00_CC_P, HA01_CC_N, HA01_CC_P, HA02_N, HA02_P, HA03_N, HA03_P, HA04_N, HA04_P, HA05_N, HA05_P, HA06_N, HA06_P, HA07_N, HA07_P, HA08_N, HA08_P, HA09_N, HA09_P, HA10_N, HA10_P, HA11_N, HA11_P, HA12_N, HA12_P, HA13_N, HA13_P, HA14_N, HA14_P, HA15_N, HA15_P, HA16_N, HA16_P, HA17_CC_N, HA17_CC_P, HA18_N, HA18_P, HA19_N, HA19_P, HA20_N, HA20_P, HA21_N, HA21_P, HA22_N, HA22_P, HA23_N, HA23_P, HB00_CC_N, HB00_CC_P, HB01_N, HB01_P, HB02_N, HB02_P, HB03_N, HB03_P, HB04_N, HB04_P, HB05_N, HB05_P, HB06_CC_N, HB06_CC_P, HB07_N, HB07_P, HB08_N, HB08_P, HB09_N, HB09_P, HB10_N, HB10_P, HB11_N, HB11_P, HB12_N, HB12_P, HB13_N, HB13_P, HB14_N, HB14_P, HB15_N, HB15_P, HB16_N, HB16_P, HB17_CC_N, HB17_CC_P, HB18_N, HB18_P, HB19_N, HB19_P, HB20_N, HB20_P, HB21_N, HB21_P, LA00_CC_N, LA00_CC_P, LA01_CC_N, LA01_CC_P, LA02_N, LA02_P, LA03_N, LA03_P, LA04_N, LA04_P, LA05_N, LA05_P, LA06_N, LA06_P, LA07_N, LA07_P, LA08_N, LA08_P, LA09_N, LA09_P, LA10_N, LA10_P, LA11_N, LA11_P, LA12_N, LA12_P, LA13_N, LA13_P, LA14_N, LA14_P, LA15_N, LA15_P, LA16_N, LA16_P, LA17_CC_N, LA17_CC_P, LA18_CC_N, LA18_CC_P, LA19_N, LA19_P, LA20_N, LA20_P, LA21_N, LA21_P, LA22_N, LA22_P, LA23_N, LA23_P, LA24_N, LA24_P, LA25_N, LA25_P, LA26_N, LA26_P, LA27_N, LA27_P, LA28_N, LA28_P, LA29_N, LA29_P, LA30_N, LA30_P, LA31_N, LA31_P, LA32_N, LA32_P, LA33_N, LA33_P
net class Power: 3P3V, 12P0V, VADJ

### Notes on the sheet
- (near J2) QUESTION:
  CLK_DIR vs RES1 (reserved, left floating)
- RES0
- VAdj is not defined as power supply and therefore as global signal as it might differ for the 2 FMC mezzanines.
- Project/Equipment
- Document
- Designer
- Drawn by
- Check.by
- Last Mod.
- Copyright WUT ISE 2019
  This documentation describes Open Hardware and is licensed under the CERN OHL v.1.1. You may redistribute and modify this documentation under the terms of the CERN OHL v1.1.
  (http://ohwr.org/CERNOHL). This documentation is dristributed WITHOUT ANY EXPRESS OR IMPLIED WARRANTY, INCLUDING OF MERCHANTABILITY, SATISFACTORY QUALITY AND FITNESS FOR A PARTICULAR PURPOSE. Please see the CERN OHL v.1.1 for applicable conditions
- File
- Print Date
- Sheet
- Size
- A2
- of
- Rev

### Library data of the parts
B1-B4 = PLATED_HOLE2.7_PAD5.0: Single Terminal Socket; Part Description: Plated Through Hole: Hole Dia.=2.7mm Pad Dia.=5.0mm; Mounted: No; Table: Pads; Part Number: PLATED_HOLE2.7_PAD5.0; Component Kind: Standard (No BOM); Component Type: Standard (No BOM); Pin Count: 1; Family: Plated Hole; Socket: No; SMD: No; Status: None; ComponentHeight: 0mm; Author: CERN DEM JMW; CreateDate: 2011-09-27; LatestRevisionDate: 2011-09-27; PackageDescription: Plated Through Hole: Hole Dia.=2.7mm Pad Dia.=5.0mm
C179 C180 C189 = CC0201_100NF_6.3V_10%_X5R: Non-polarised capacitor; Part Description: SMD Multilayer Chip Ceramic Capacitor; Manufacturer: GENERIC; Manufacturer1 Part Number: 02016D104KAT2A; Voltage: 6.3V; TC: X5R; Tolerance: ±10%; Table: Capacitors SMD; Part Number: CC0201_100NF_6.3V_10%_X5R; Component Kind: Standard; Component Type: Standard; Pin Count: 2; Value: 100nF; Status: Not Recommended; Manufacturer Part Number: CC0201_100NF_6.3V_10%_X5R; Case: 0201; Mounted: Yes; Socket: No; SMD: Yes; Manufacturer1 Example: AVX; Manufacturer1 ComponentHeight: 0.33mm; HelpURL: \\cern.ch\dfs\Applications\Altium\Datasheets\CC0201_X5R_AVX.pdf; Author: CERN DEM JLC; CreateDate: 2007-12-03; LatestRevisionDate: 2007-12-03
C181 C184 C187 = CC1206_22UF_10V_10%_X7R: Non-polarised capacitor; Part Description: SMD Multilayer Chip Ceramic Capacitor; Manufacturer: GENERIC; Manufacturer1 Part Number: GRM31CR71A226KE15L; Voltage: 10V; TC: X7R; Tolerance: ±10%; Table: Capacitors SMD; Part Number: CC1206_22UF_10V_10%_X7R; Component Kind: Standard; Component Type: Standard; Pin Count: 2; Value: 22uF; Status: Preferred; Manufacturer Part Number: CC1206_22UF_10V_10%_X7R; Case: 1206; Mounted: Yes; Socket: No; SMD: Yes; Manufacturer1 Example: MURATA; Manufacturer1 ComponentHeight: 1.8mm; HelpURL: \\cern.ch\dfs\Applications\Altium\Datasheets\CC1206_X7R_MURATA_GRM-HI-CAP.pdf; Author: CERN DEM JLC; CreateDate: 2010-06-08; LatestRevisionDate: 2010-06-08
C183 C185 C192 C193 = CC0603_1UF_25V_10%_X7R: Non-polarised capacitor; Part Description: SMD Multilayer Chip Ceramic Capacitor; Manufacturer: GENERIC; Manufacturer1 Part Number: GRM188R71E105KA12D; Voltage: 25V; TC: X7R; Tolerance: ±10%; Part Number: CC0603_1UF_25V_10%_X7R; Component Kind: Standard; Component Type: Standard; Pin Count: 2; Value: 1uF; Status: None; Manufacturer Part Number: CC0603_1UF_25V_10%_X7R; Case: 0603; Mounted: Yes; Socket: No; SMD: Yes; Sense: No; Manufacturer1 Example: MURATA; Manufacturer1 ComponentHeight: 0.9mm; HelpURL: \\cern.ch\dfs\Applications\Altium\Datasheets\CC0603_X7R_MURATA.pdf; Author: CERN DEM JLC; CreateDate: 18/01/2011; LatestRevisionDate: 18/01/2011
C190 = CC0805_10UF_16V_10%_X5R: Non-polarised capacitor; Part Description: SMD Multilayer Chip Ceramic Capacitor; Manufacturer: GENERIC; Manufacturer1 Part Number: C0805C106K4PAC; Voltage: 16V; TC: X5R; Tolerance: ±10%; Table: Capacitors SMD; Part Number: CC0805_10UF_16V_10%_X5R; Component Kind: Standard; Component Type: Standard; Pin Count: 2; Value: 10uF; Status: Preferred; Manufacturer Part Number: CC0805_10UF_16V_10%_X5R; Case: 0805; Mounted: Yes; Socket: No; SMD: Yes; Manufacturer1 Example: KEMET; Manufacturer1 ComponentHeight: 1.4mm; HelpURL: \\cern.ch\dfs\Applications\Altium\Datasheets\CC1206_X5R_KEMET.pdf; Author: CERN DEM JLC; CreateDate: 2007-12-03; LatestRevisionDate: 2007-12-03
J2 = SAMTEC_ASP-134486-01: Connector VITA 57, 400 Female contacts in 10 row abcdefghj; Part Description: 400 contacts (10 rows abcdefghj) Surface Mount Female Connector, VITA 57; Manufacturer: SAMTEC; Part Number: SAMTEC_ASP-134486-01; Component Kind: Standard; Component Type: Standard; Pin Count: 400; Family: VITA 57; Mounted: Yes; Socket: No; SMD: Yes; Status: None; Manufacturer Part Number: ASP-134486-01; ComponentHeight: 6.55mm; HelpURL: \\cern.ch\dfs\Applications\Altium\Datasheets\SAMTEC_ASP-134486-01.pdf; Author: CERN DEM JLC; CreateDate: 30/04/2009; LatestRevisionDate: 17/08/2009; Table: SAMTEC

## Sheet FPGA_FMC.SchDoc: SVPXFMC Carrier 3U
size 420 x 297 mm; CheckedBy: \; Author: G.Kasprowicz; CompanyName: ISE; DrawnBy: T.Przywozki; Organization: WUT ISE; Address1: Warsaw University of Technology; Address2: Nowowiejska 15/19 00-665 Warsaw; Revision: 1.0.; SheetNumber: 8; SheetTotal: 20; Project: SVPXFMC Carrier 3U; ModifiedBy: -; CheckedDate: -; Title2: FPGA FMC; DivGrp: ISE; Designer: G. Kasprowicz
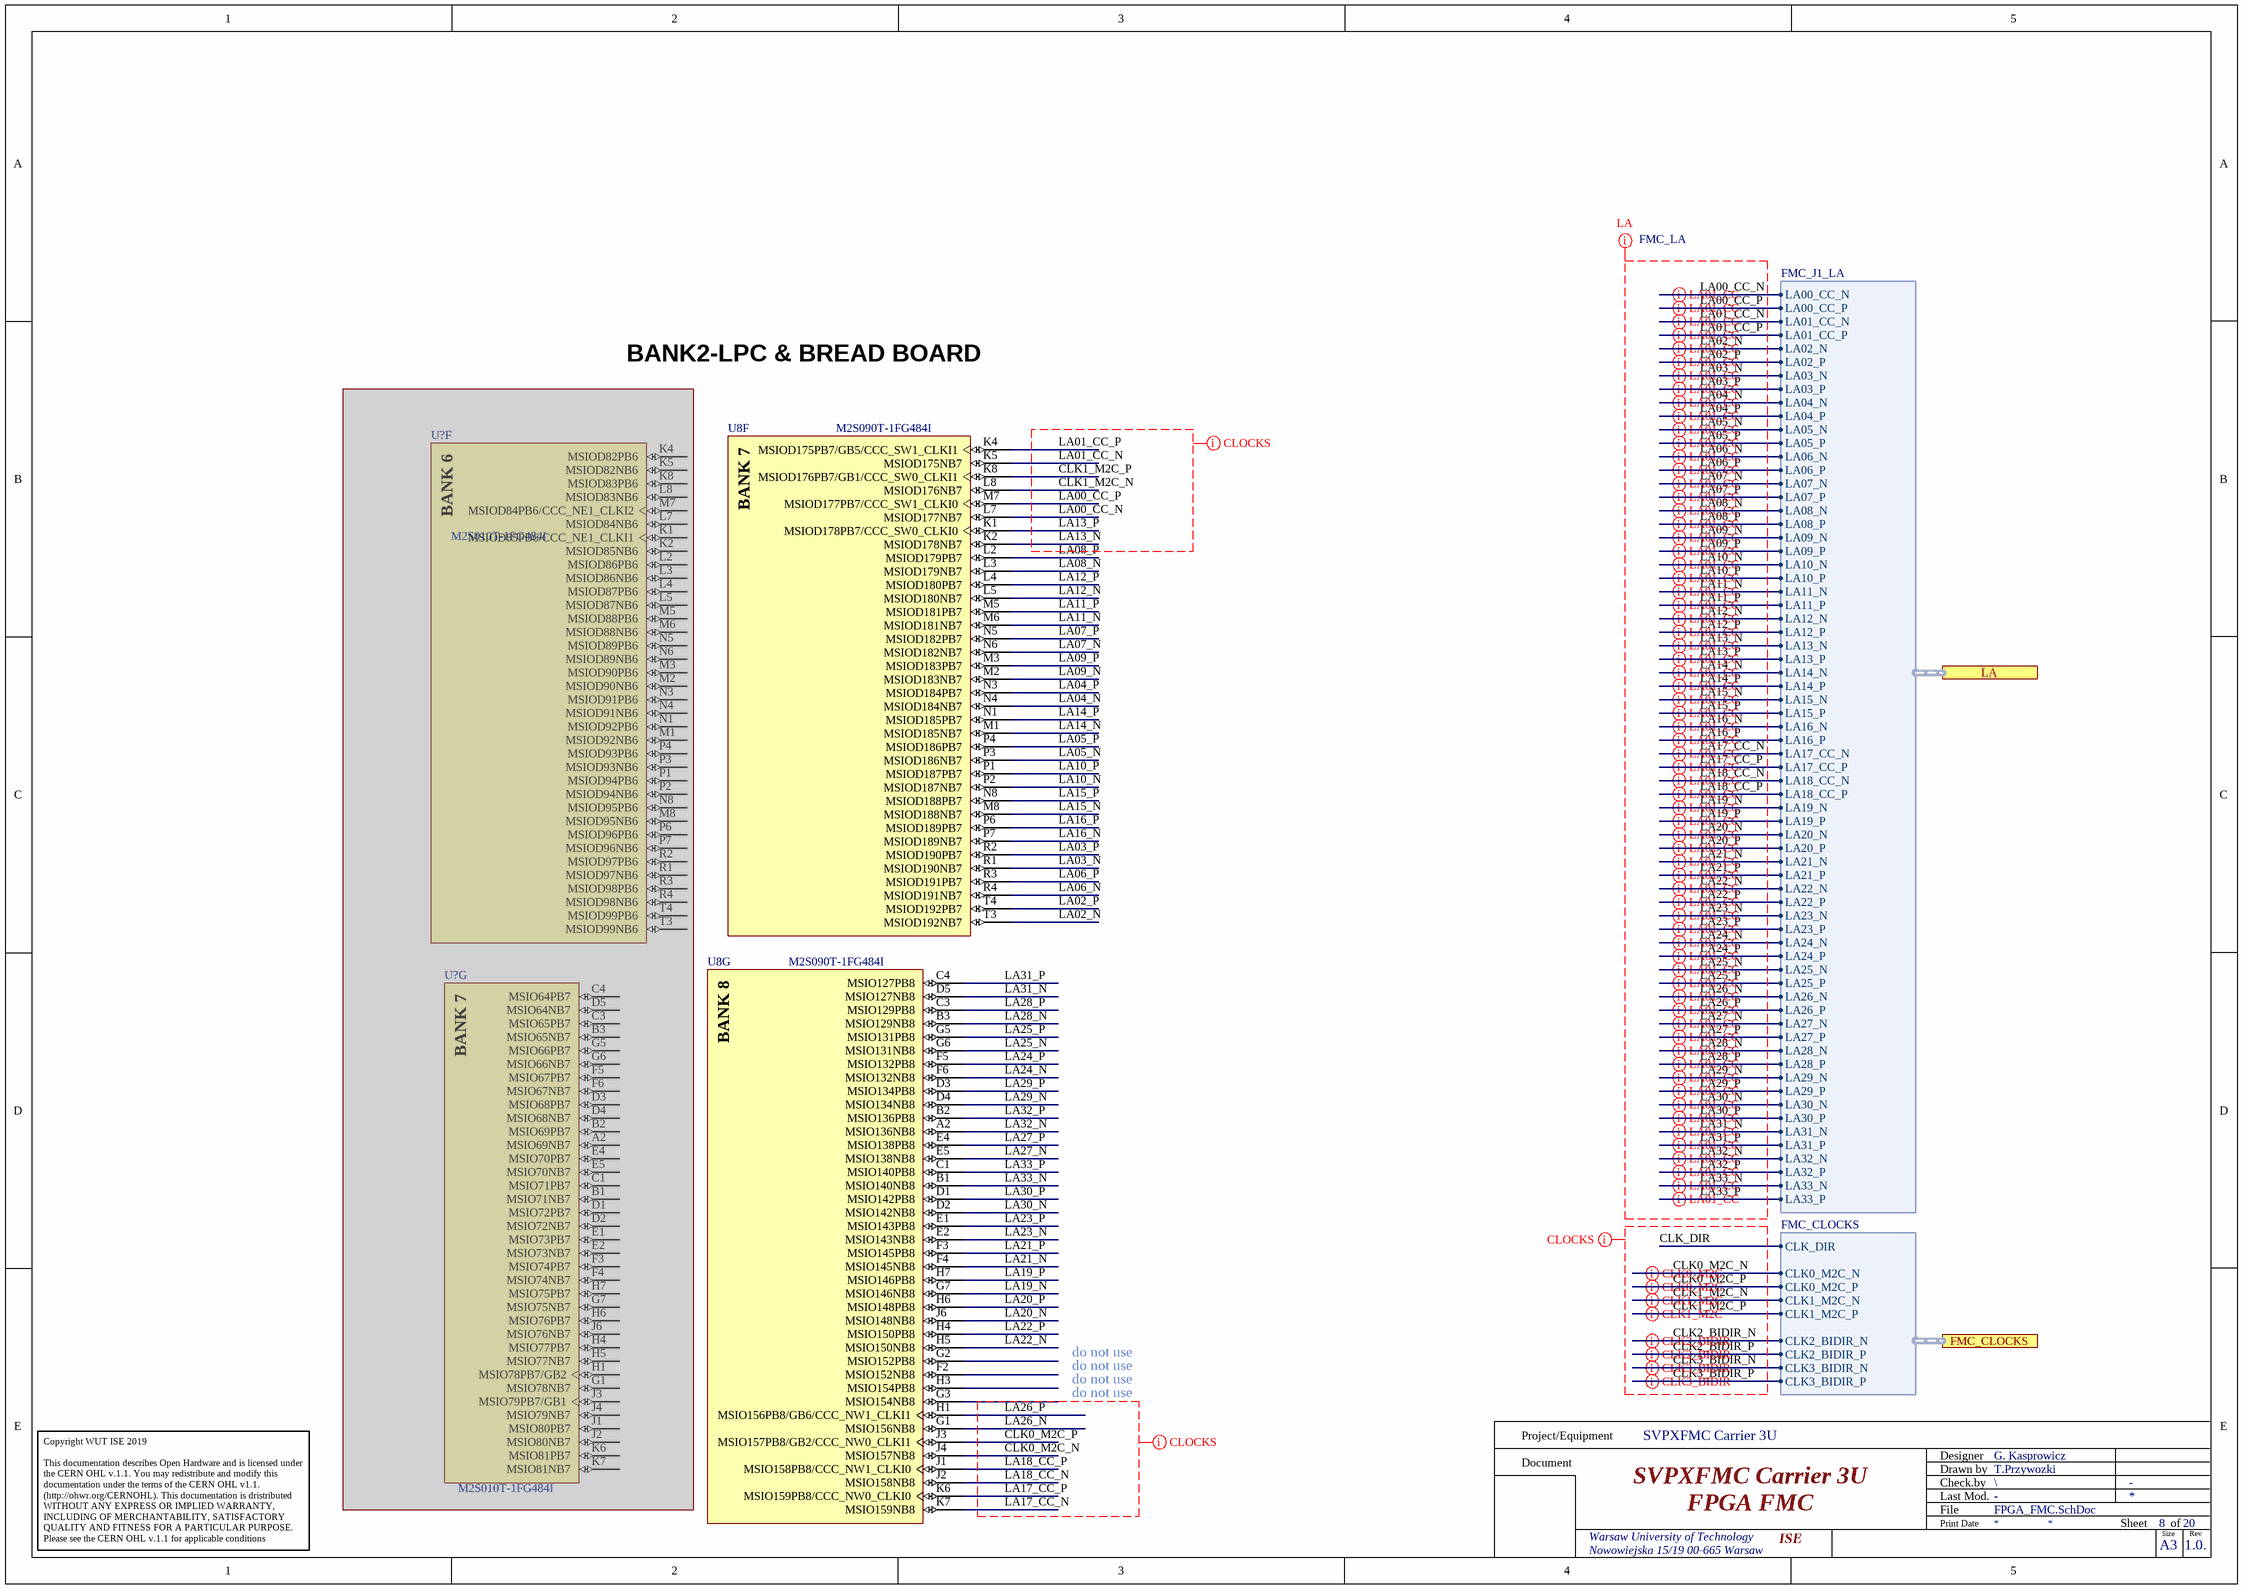
[diagram p3: FPGA_FMC.SchDoc]

### Parts
(Parts that share a designator on the sheet are numbered #1, #2 ... from top to bottom, then left to right.)
U8  M2S090T-1FG484I  [MCSM-FG-484_V]  (parts F,G of 15)
U?#1  M2S010T-1FG484I  [MCSM-FG-484_V]  (part F of 16)  (masked out: inside a compile mask, not in the netlist)
U?#2  M2S010T-1FG484I  [MCSM-FG-484_V]  (part G of 16)  (masked out: inside a compile mask, not in the netlist)

### Ports
FMC_CLOCKS (harness FMC_CLOCKS), LA (harness FMC_J1_LA)

### Harnesses
FMC_J1_LA: LA05_N, LA05_P, LA06_N, LA06_P, LA09_N, LA09_P, LA10_N, LA10_P, LA13_N, LA13_P, LA14_N, LA14_P, LA23_N, LA23_P, LA26_N, LA26_P, LA27_N, LA27_P, LA02_N, LA02_P, LA03_N, LA03_P, LA04_N, LA04_P, LA07_N, LA07_P, LA08_N, LA08_P, LA11_N, LA11_P, LA12_N, LA12_P, LA15_N, LA15_P, LA16_N, LA16_P, LA19_N, LA19_P, LA20_N, LA20_P, LA21_N, LA21_P, LA22_N, LA22_P, LA24_N, LA24_P, LA25_N, LA25_P, LA28_N, LA28_P, LA29_N, LA29_P, LA30_N, LA30_P, LA31_N, LA31_P, LA32_N, LA32_P, LA33_N, LA33_P, LA00_CC_N, LA00_CC_P, LA01_CC_N, LA01_CC_P, LA17_CC_N, LA17_CC_P, LA18_CC_N, LA18_CC_P
FMC_CLOCKS: CLK2_BIDIR_N, CLK2_BIDIR_P, CLK3_BIDIR_N, CLK3_BIDIR_P, CLK0_M2C_N, CLK0_M2C_P, CLK1_M2C_N, CLK1_M2C_P, CLK_DIR

### Nets
CLK0_M2C_N: U8.J4(MSIO157NB8) ; port FMC_CLOCKS.CLK0_M2C_N
CLK0_M2C_P: U8.J3(MSIO157PB8/GB2/CCC_NW0_CLKI1) ; port FMC_CLOCKS.CLK0_M2C_P
CLK1_M2C_N: U8.L8(MSIOD176NB7) ; port FMC_CLOCKS.CLK1_M2C_N
CLK1_M2C_P: U8.K8(MSIOD176PB7/GB1/CCC_SW0_CLKI1) ; port FMC_CLOCKS.CLK1_M2C_P
LA00_CC_N: U8.L7(MSIOD177NB7) ; port LA.LA00_CC_N
LA00_CC_P: U8.M7(MSIOD177PB7/CCC_SW1_CLKI0) ; port LA.LA00_CC_P
LA01_CC_N: U8.K5(MSIOD175NB7) ; port LA.LA01_CC_N
LA01_CC_P: U8.K4(MSIOD175PB7/GB5/CCC_SW1_CLKI1) ; port LA.LA01_CC_P
LA02_N: U8.T3(MSIOD192NB7) ; port LA.LA02_N
LA02_P: U8.T4(MSIOD192PB7) ; port LA.LA02_P
LA03_N: U8.R1(MSIOD190NB7) ; port LA.LA03_N
LA03_P: U8.R2(MSIOD190PB7) ; port LA.LA03_P
LA04_N: U8.N4(MSIOD184NB7) ; port LA.LA04_N
LA04_P: U8.N3(MSIOD184PB7) ; port LA.LA04_P
LA05_N: U8.P3(MSIOD186NB7) ; port LA.LA05_N
LA05_P: U8.P4(MSIOD186PB7) ; port LA.LA05_P
LA06_N: U8.R4(MSIOD191NB7) ; port LA.LA06_N
LA06_P: U8.R3(MSIOD191PB7) ; port LA.LA06_P
LA07_N: U8.N6(MSIOD182NB7) ; port LA.LA07_N
LA07_P: U8.N5(MSIOD182PB7) ; port LA.LA07_P
LA08_N: U8.L3(MSIOD179NB7) ; port LA.LA08_N
LA08_P: U8.L2(MSIOD179PB7) ; port LA.LA08_P
LA09_N: U8.M2(MSIOD183NB7) ; port LA.LA09_N
LA09_P: U8.M3(MSIOD183PB7) ; port LA.LA09_P
LA10_N: U8.P2(MSIOD187NB7) ; port LA.LA10_N
LA10_P: U8.P1(MSIOD187PB7) ; port LA.LA10_P
LA11_N: U8.M6(MSIOD181NB7) ; port LA.LA11_N
LA11_P: U8.M5(MSIOD181PB7) ; port LA.LA11_P
LA12_N: U8.L5(MSIOD180NB7) ; port LA.LA12_N
LA12_P: U8.L4(MSIOD180PB7) ; port LA.LA12_P
LA13_N: U8.K2(MSIOD178NB7) ; port LA.LA13_N
LA13_P: U8.K1(MSIOD178PB7/CCC_SW0_CLKI0) ; port LA.LA13_P
LA14_N: U8.M1(MSIOD185NB7) ; port LA.LA14_N
LA14_P: U8.N1(MSIOD185PB7) ; port LA.LA14_P
LA15_N: U8.M8(MSIOD188NB7) ; port LA.LA15_N
LA15_P: U8.N8(MSIOD188PB7) ; port LA.LA15_P
LA16_N: U8.P7(MSIOD189NB7) ; port LA.LA16_N
LA16_P: U8.P6(MSIOD189PB7) ; port LA.LA16_P
LA17_CC_N: U8.K7(MSIO159NB8) ; port LA.LA17_CC_N
LA17_CC_P: U8.K6(MSIO159PB8/CCC_NW0_CLKI0) ; port LA.LA17_CC_P
LA18_CC_N: U8.J2(MSIO158NB8) ; port LA.LA18_CC_N
LA18_CC_P: U8.J1(MSIO158PB8/CCC_NW1_CLKI0) ; port LA.LA18_CC_P
LA19_N: U8.G7(MSIO146NB8) ; port LA.LA19_N
LA19_P: U8.H7(MSIO146PB8) ; port LA.LA19_P
LA20_N: U8.J6(MSIO148NB8) ; port LA.LA20_N
LA20_P: U8.H6(MSIO148PB8) ; port LA.LA20_P
LA21_N: U8.F4(MSIO145NB8) ; port LA.LA21_N
LA21_P: U8.F3(MSIO145PB8) ; port LA.LA21_P
LA22_N: U8.H5(MSIO150NB8) ; port LA.LA22_N
LA22_P: U8.H4(MSIO150PB8) ; port LA.LA22_P
LA23_N: U8.E2(MSIO143NB8) ; port LA.LA23_N
LA23_P: U8.E1(MSIO143PB8) ; port LA.LA23_P
LA24_N: U8.F6(MSIO132NB8) ; port LA.LA24_N
LA24_P: U8.F5(MSIO132PB8) ; port LA.LA24_P
LA25_N: U8.G6(MSIO131NB8) ; port LA.LA25_N
LA25_P: U8.G5(MSIO131PB8) ; port LA.LA25_P
LA26_N: U8.G1(MSIO156NB8) ; port LA.LA26_N
LA26_P: U8.H1(MSIO156PB8/GB6/CCC_NW1_CLKI1) ; port LA.LA26_P
LA27_N: U8.E5(MSIO138NB8) ; port LA.LA27_N
LA27_P: U8.E4(MSIO138PB8) ; port LA.LA27_P
LA28_N: U8.B3(MSIO129NB8) ; port LA.LA28_N
LA28_P: U8.C3(MSIO129PB8) ; port LA.LA28_P
LA29_N: U8.D4(MSIO134NB8) ; port LA.LA29_N
LA29_P: U8.D3(MSIO134PB8) ; port LA.LA29_P
LA30_N: U8.D2(MSIO142NB8) ; port LA.LA30_N
LA30_P: U8.D1(MSIO142PB8) ; port LA.LA30_P
LA31_N: U8.D5(MSIO127NB8) ; port LA.LA31_N
LA31_P: U8.C4(MSIO127PB8) ; port LA.LA31_P
LA32_N: U8.A2(MSIO136NB8) ; port LA.LA32_N
LA32_P: U8.B2(MSIO136PB8) ; port LA.LA32_P
LA33_N: U8.B1(MSIO140NB8) ; port LA.LA33_N
LA33_P: U8.C1(MSIO140PB8) ; port LA.LA33_P

Not connected (* = marked no-connect by the designer): U8 F2(MSIO152NB8) G2(MSIO152PB8) G3(MSIO154NB8) H3(MSIO154PB8)

### Layout directives
differential pair; differential pair class Diff_100; differential pair class Diff_LA: LA00_CC_N, LA00_CC_P, LA01_CC_N, LA01_CC_P, LA02_N, LA02_P, LA03_N, LA03_P, LA04_N, LA04_P, LA05_N, LA05_P, LA06_N, LA06_P, LA07_N, LA07_P, LA08_N, LA08_P, LA09_N, LA09_P, LA10_N, LA10_P, LA11_N, LA11_P, LA12_N, LA12_P, LA13_N, LA13_P, LA14_N, LA14_P, LA15_N, LA15_P, LA16_N, LA16_P, LA17_CC_N, LA17_CC_P, LA18_CC_N, LA18_CC_P, LA19_N, LA19_P, LA20_N, LA20_P, LA21_N, LA21_P, LA22_N, LA22_P, LA23_N, LA23_P, LA24_N, LA24_P, LA25_N, LA25_P, LA26_N, LA26_P, LA27_N, LA27_P, LA28_N, LA28_P, LA29_N, LA29_P, LA30_N, LA30_P, LA31_N, LA31_P, LA32_N, LA32_P, LA33_N, LA33_P
differential pair: CLK0_M2C_N, CLK0_M2C_P, CLK1_M2C_N, CLK1_M2C_P, CLK2_BIDIR_N, CLK2_BIDIR_P, CLK3_BIDIR_N, CLK3_BIDIR_P
net class FMC_LA: LA00_CC_N, LA00_CC_P, LA01_CC_N, LA01_CC_P, LA02_N, LA02_P, LA03_N, LA03_P, LA04_N, LA04_P, LA05_N, LA05_P, LA06_N, LA06_P, LA07_N, LA07_P, LA08_N, LA08_P, LA09_N, LA09_P, LA10_N, LA10_P, LA11_N, LA11_P, LA12_N, LA12_P, LA13_N, LA13_P, LA14_N, LA14_P, LA15_N, LA15_P, LA16_N, LA16_P, LA17_CC_N, LA17_CC_P, LA18_CC_N, LA18_CC_P, LA19_N, LA19_P, LA20_N, LA20_P, LA21_N, LA21_P, LA22_N, LA22_P, LA23_N, LA23_P, LA24_N, LA24_P, LA25_N, LA25_P, LA26_N, LA26_P, LA27_N, LA27_P, LA28_N, LA28_P, LA29_N, LA29_P, LA30_N, LA30_P, LA31_N, LA31_P, LA32_N, LA32_P, LA33_N, LA33_P
net class FMC_CLKs: CLK0_M2C_N, CLK0_M2C_P, CLK1_M2C_N, CLK1_M2C_P, CLK2_BIDIR_N, CLK2_BIDIR_P, CLK3_BIDIR_N, CLK3_BIDIR_P, CLK_DIR, LA00_CC_N, LA00_CC_P, LA01_CC_N, LA01_CC_P, LA13_N, LA13_P, LA17_CC_N, LA17_CC_P, LA18_CC_N, LA18_CC_P, LA26_N, LA26_P

### Notes on the sheet
- BANK2-LPC & BREAD BOARD
- do not use
- Project/Equipment
- Document
- Designer
- Drawn by
- Check.by
- File
- Last Mod.
- Print Date
- Sheet
- Size
- A3
- of
- Rev
- Copyright WUT ISE 2019
  This documentation describes Open Hardware and is licensed under the CERN OHL v.1.1. You may redistribute and modify this documentation under the terms of the CERN OHL v1.1.
  (http://ohwr.org/CERNOHL). This documentation is dristributed WITHOUT ANY EXPRESS OR IMPLIED WARRANTY, INCLUDING OF MERCHANTABILITY, SATISFACTORY QUALITY AND FITNESS FOR A PARTICULAR PURPOSE. Please see the CERN OHL v.1.1 for applicable conditions
- (in symbol CMP-0959-00045-1, part F) BANK 7
- (in symbol CMP-0959-00045-1, part G) BANK 8
- (in symbol CMP-0959-00069-1, part F) BANK 6
- (in symbol CMP-0959-00069-1, part G) BANK 7

### Library data of the parts
U8 = CMP-0959-00045-1: SmartFusion2 SoC FPGA, ARM Cortex-M3, 90 K LUTs, 267 User I/O, Transceiver Available, Design Security, Speed Grade 1, -40 to 100 degC, 484-Ball BGA; Manufacturer: Microsemi; Total User I/O: 267; PLLs and CCCs: 6; LSRAM 18K Blocks: 109; eNVM (K Bytes): 512; DDR Controllers (Count x Width): 1x18; Math Blocks (18x18): 84; Maximum Logic Elements: 86,316; eSRAM (K Bytes): 64; MSIOD (2.5V): 40; SERDES Lanes: 4; MSIO (3.3V): 157; Total RAM (K bits): 2074; DDRIO (2.5V): 70; uSRAM1K Blocks: 112; eSRAM (K Bytes) Non SECDED: 80; ComponentLink3URL: http://www.microsemi.com/document-portal/doc_download/131095-package-mechanical-drawings; DatasheetVersion: Rev. 5; ComponentLink3Description: Package Specification; ComponentLink1Description: Manufacturer URL; PackageReference: FG-484; RoHS: FALSE; ComponentLink1URL: http://www.microsemi.com/; Code_JEDEC: MS-034; Mounting Technology: Surface Mount; PackageDescription: 484-Ball Fine Pitch Plastic Ball Grid Array (FBGA), Body 23 x 23 mm, Pitch 1 mm; PackageVersion: Rev. 48, 11/2013; ComponentLink2URL: http://www.microsemi.com/document-portal/doc_download/130717-smartfusion2-datasheet; PartNumber: M2S090T-1FG484I; ComponentLink2Description: Datasheet; PartId: 1
U?#1 U?#2 = CMP-0959-00069-1: SmartFusion2 SoC FPGA, ARM Cortex-M3, 10 K LUTs, 233 User I/O, Transceiver Available, Design Security, Speed Grade 1, -40 to 100 degC, 484-Ball BGA; Manufacturer: Microsemi; MSIO (3.3V): 123; DDRIO (2.5V): 70; eSRAM (K Bytes): 64; uSRAM1K Blocks: 22; SERDES Lanes: 4; DDR Controllers (Count x Width): 1x18; MSIOD (2.5V): 40; Maximum Logic Elements: 12,084; eNVM (K Bytes): 256; PLLs and CCCs: 2; LSRAM 18K Blocks: 21; eSRAM (K Bytes) Non SECDED: 80; Total RAM (K bits): 400; Total User I/O: 233; PackageVersion: Rev. 48, 11/2013; ComponentLink3URL: http://www.microsemi.com/document-portal/doc_download/131095-package-mechanical-drawings; ComponentLink1Description: Manufacturer URL; DatasheetVersion: Rev. 5; RoHS: FALSE; ComponentLink2Description: Datasheet; Code_JEDEC: MS-034; ComponentLink3Description: Package Specification; ComponentLink2URL: http://www.microsemi.com/document-portal/doc_download/130717-smartfusion2-datasheet; PartNumber: M2S010T-1FG484I; ComponentLink1URL: http://www.microsemi.com/; Math Blocks (18x18): 22; Mounting Technology: Surface Mount; PackageDescription: 484-Ball Fine Pitch Plastic Ball Grid Array (FBGA), Body 23 x 23 mm, Pitch 1 mm; PackageReference: FG-484